# EAGLE schematic Micro_8086_Programming (2) (EAGLE 9.6.2), part 1 of 2
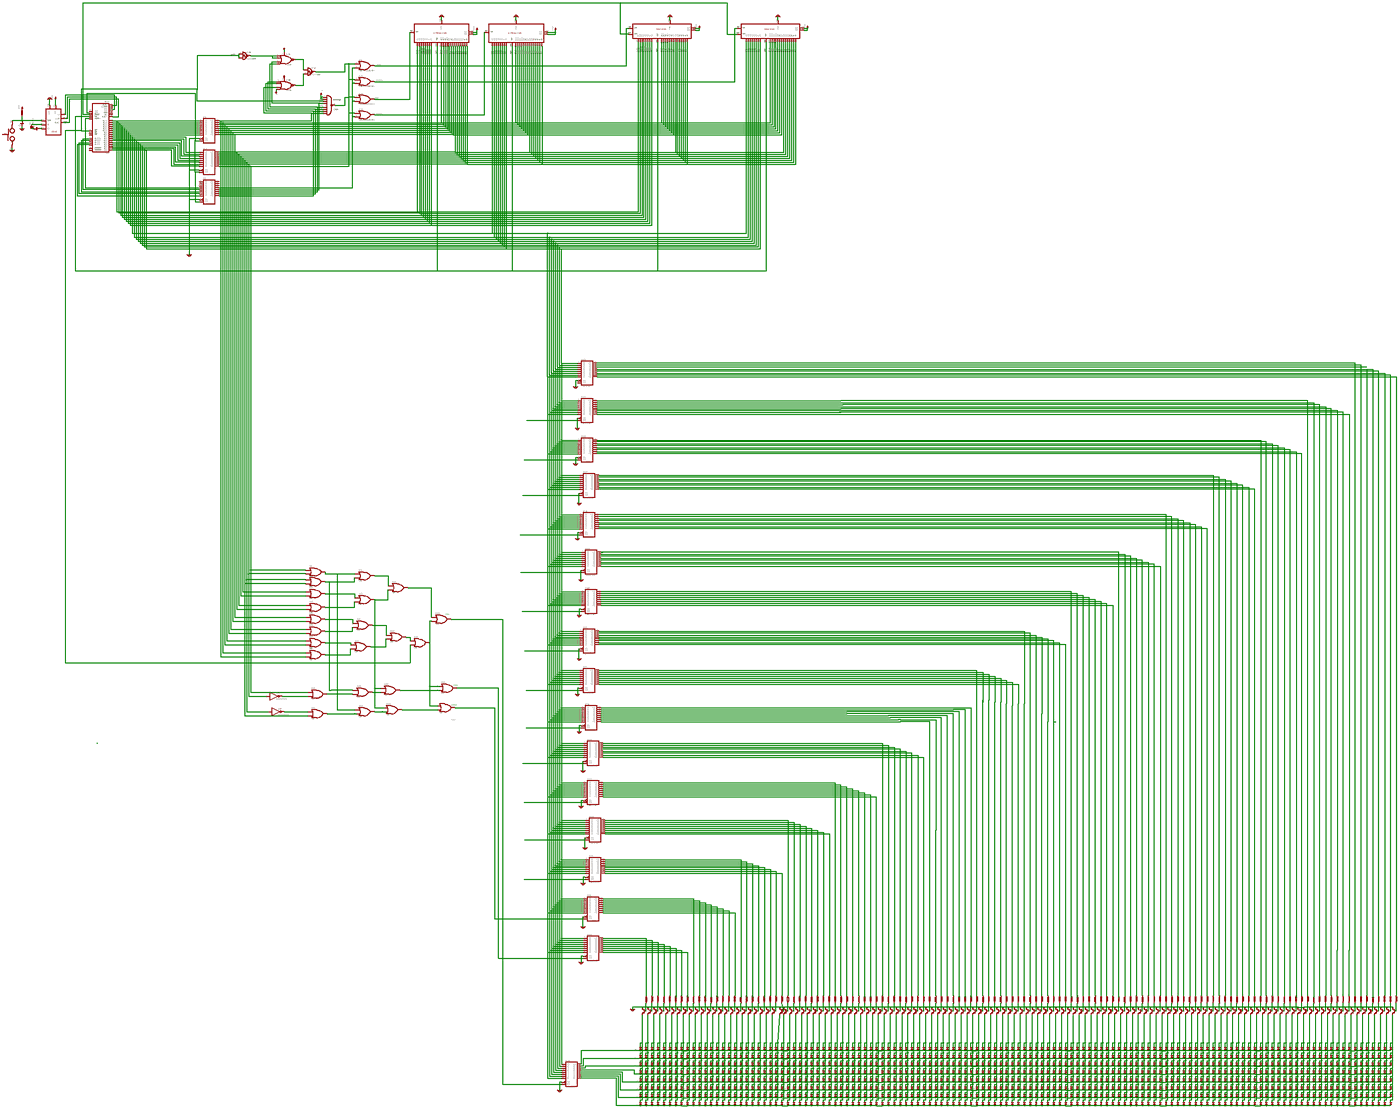
[diagram p0: schematic, sheet 1, overview]
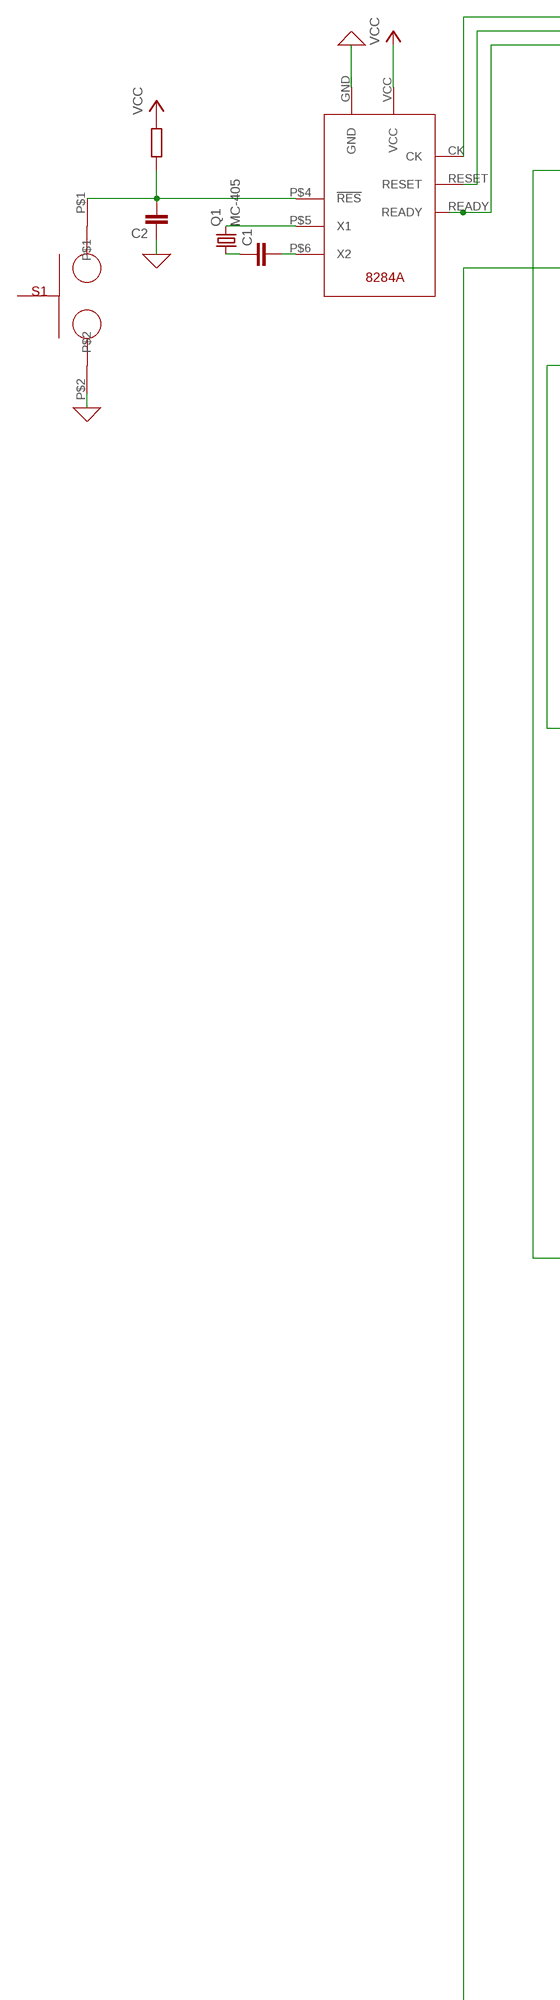
[diagram p1: schematic, sheet 1, part 1 of 8]
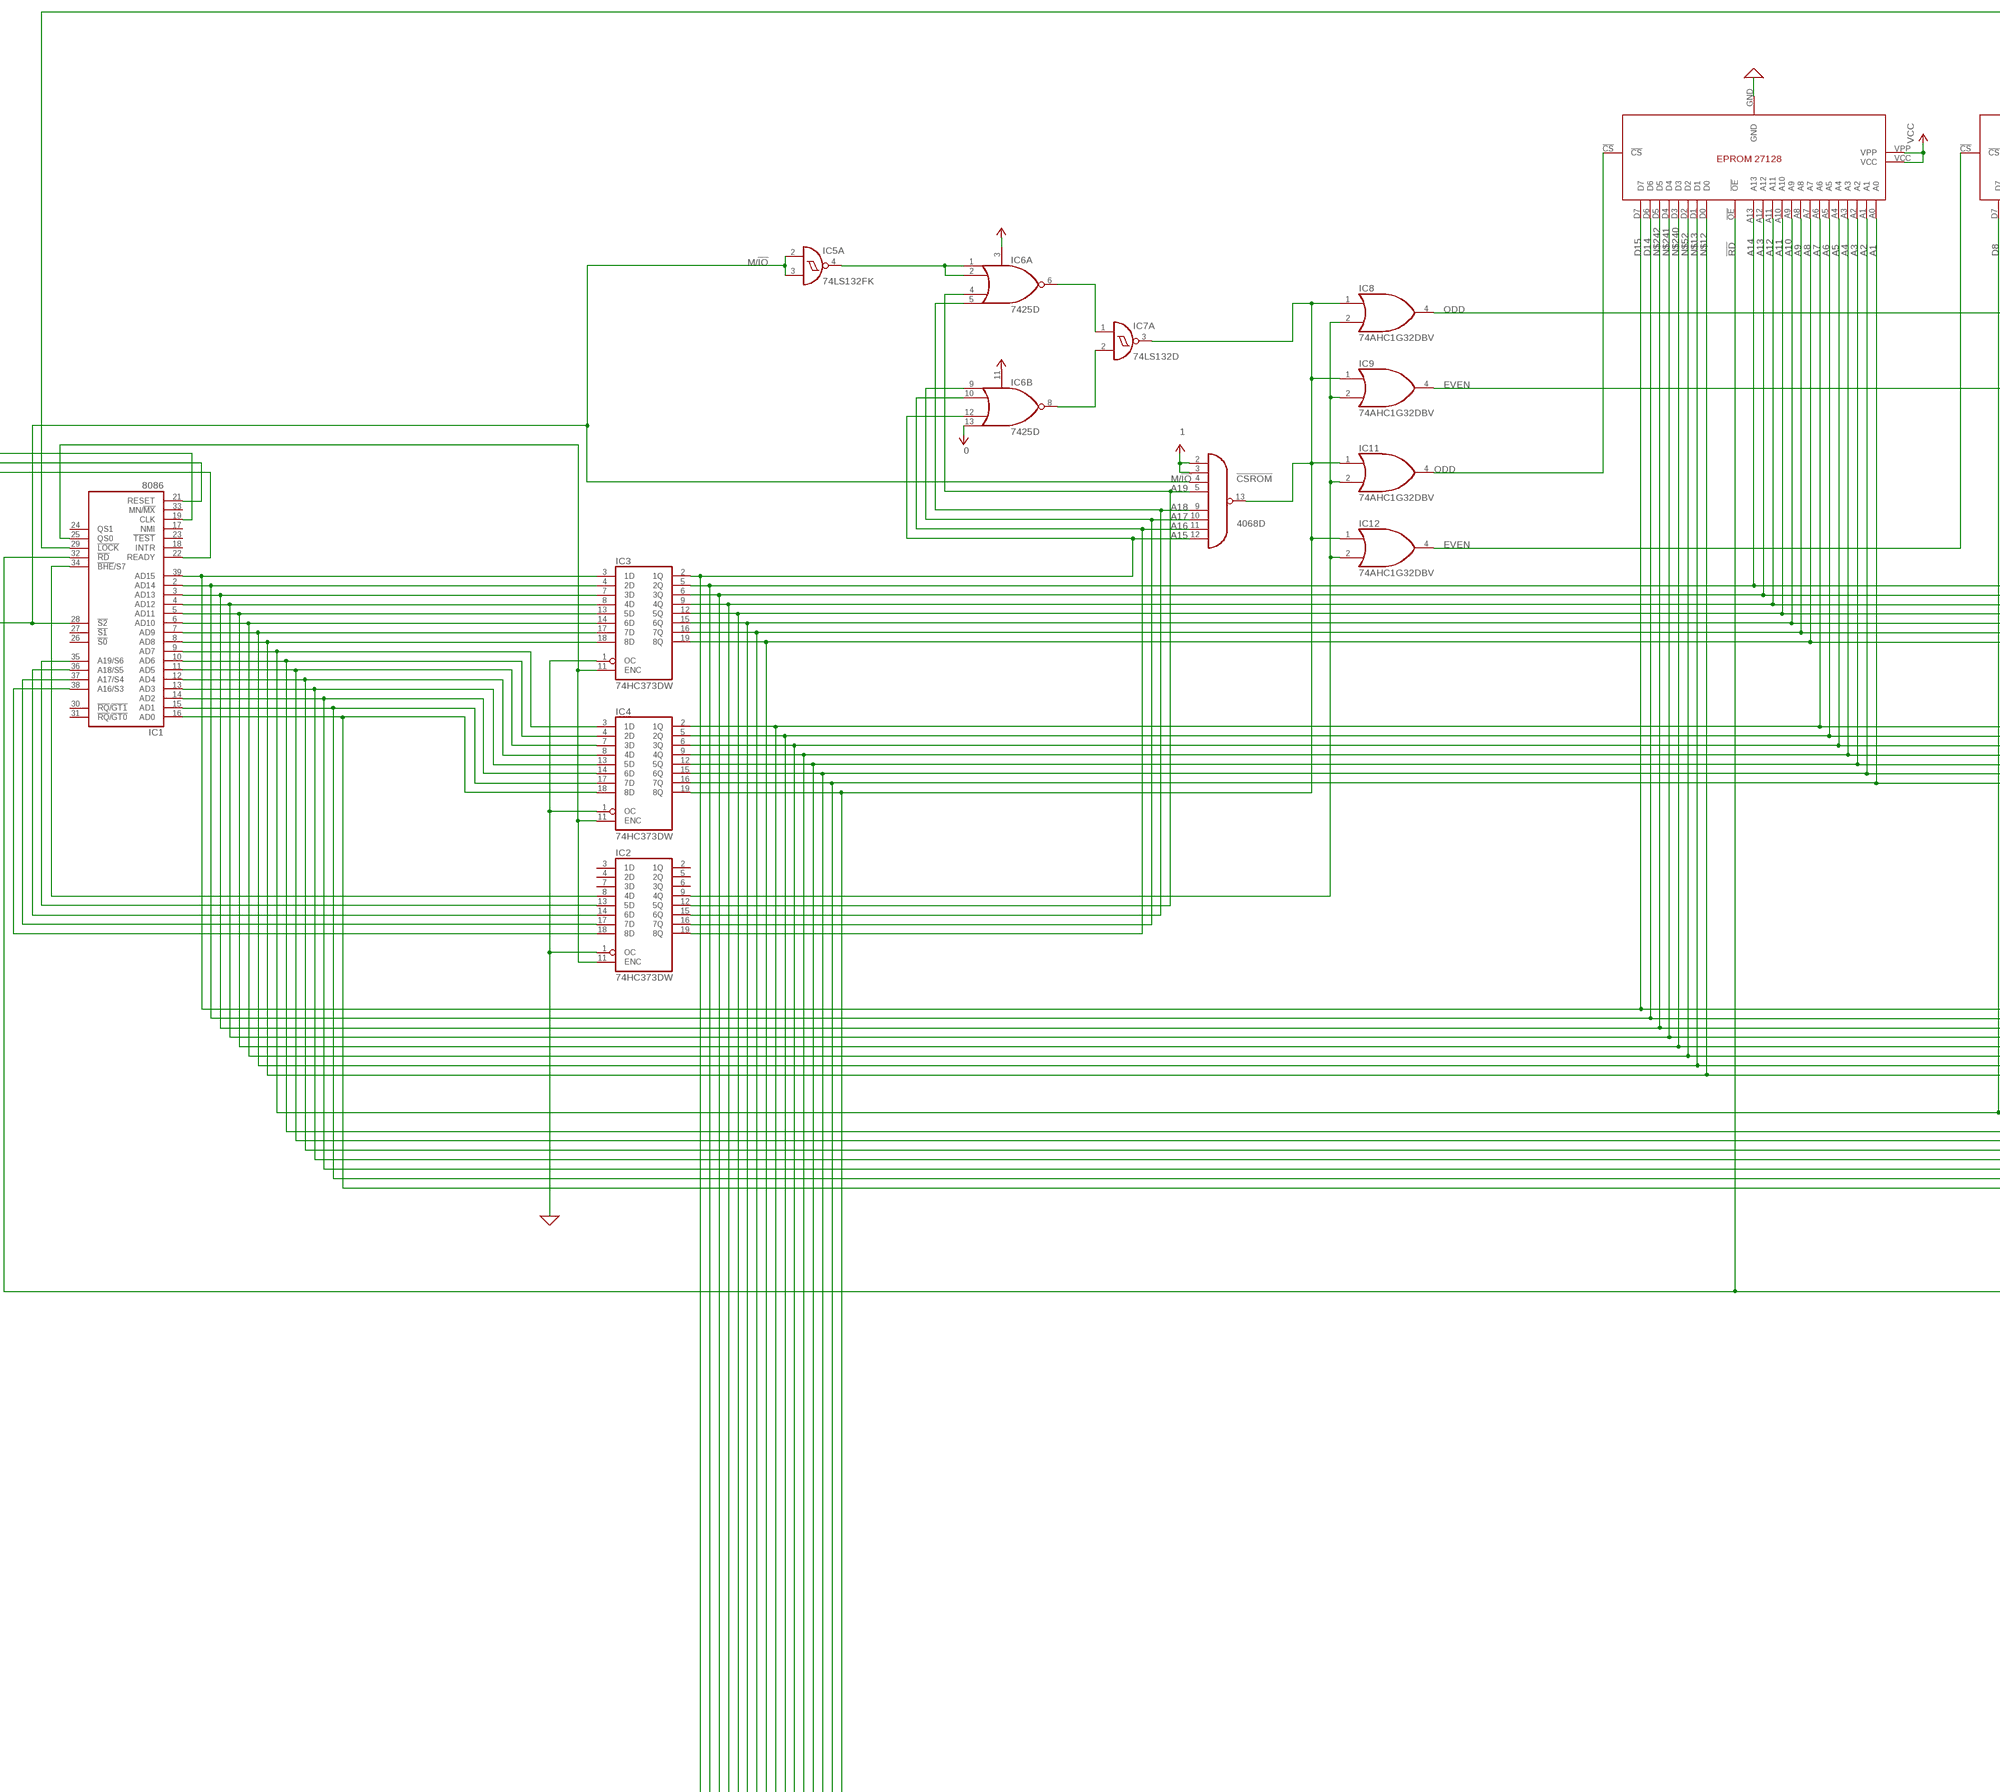
[diagram p2: schematic, sheet 1, part 2 of 8]
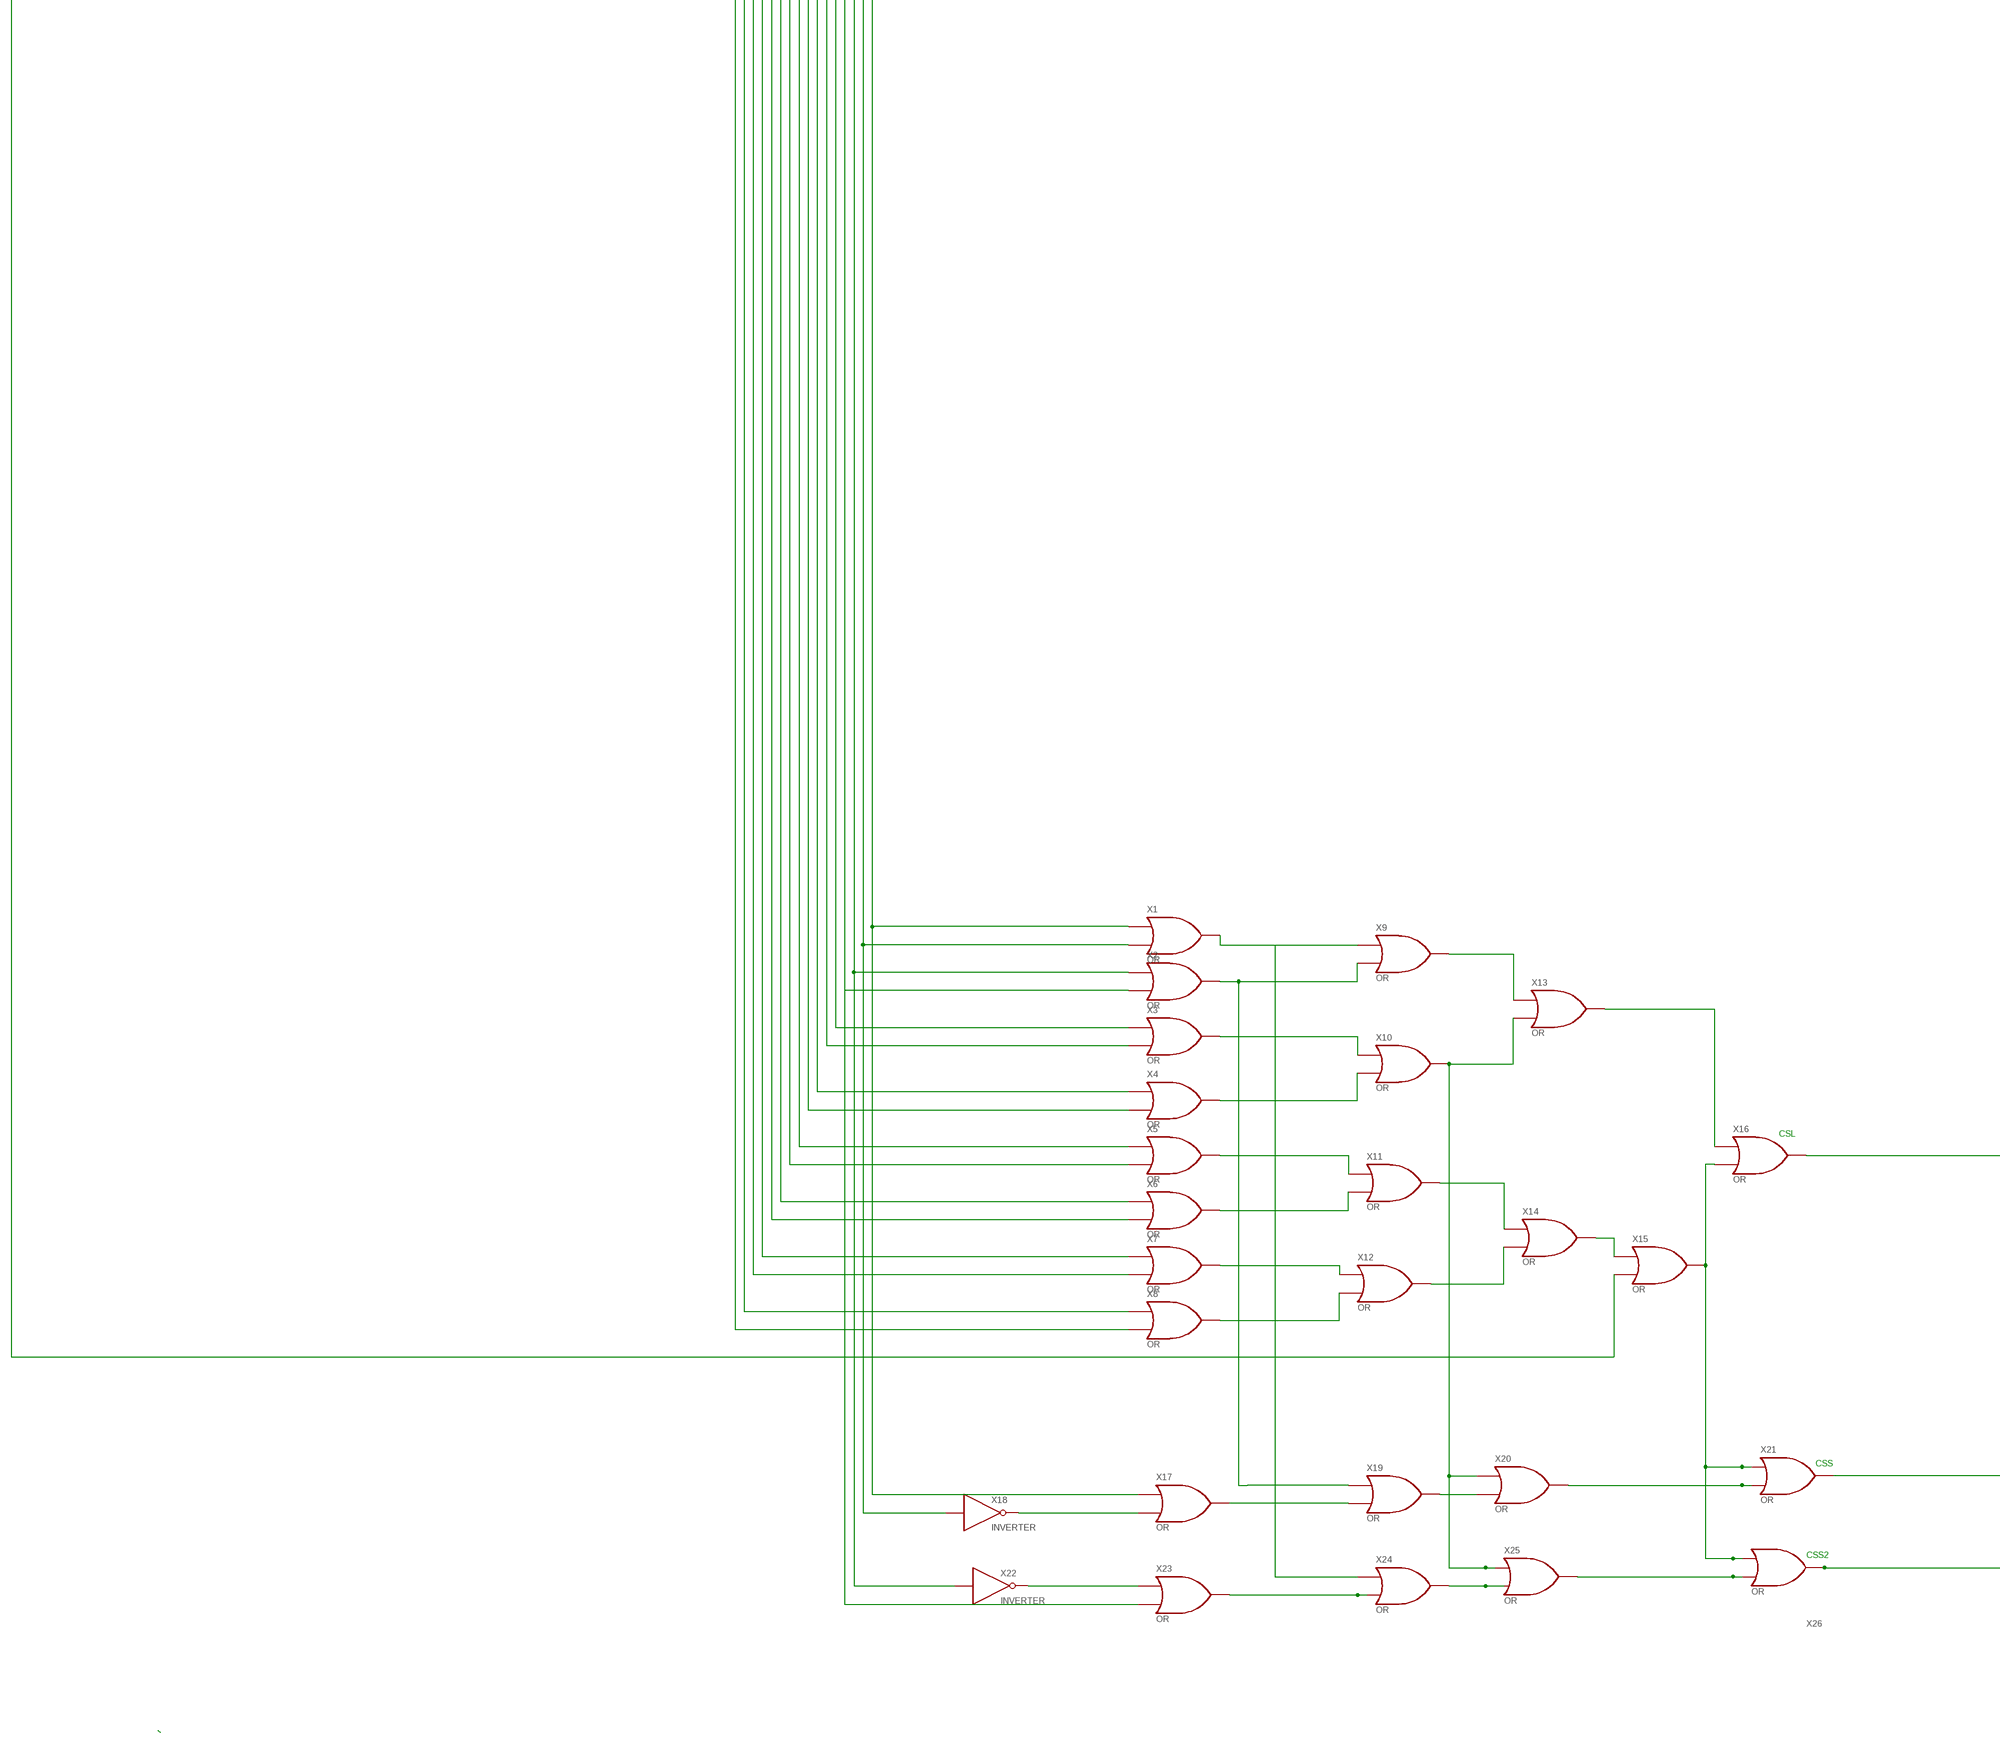
[diagram p3: schematic, sheet 1, part 3 of 8]
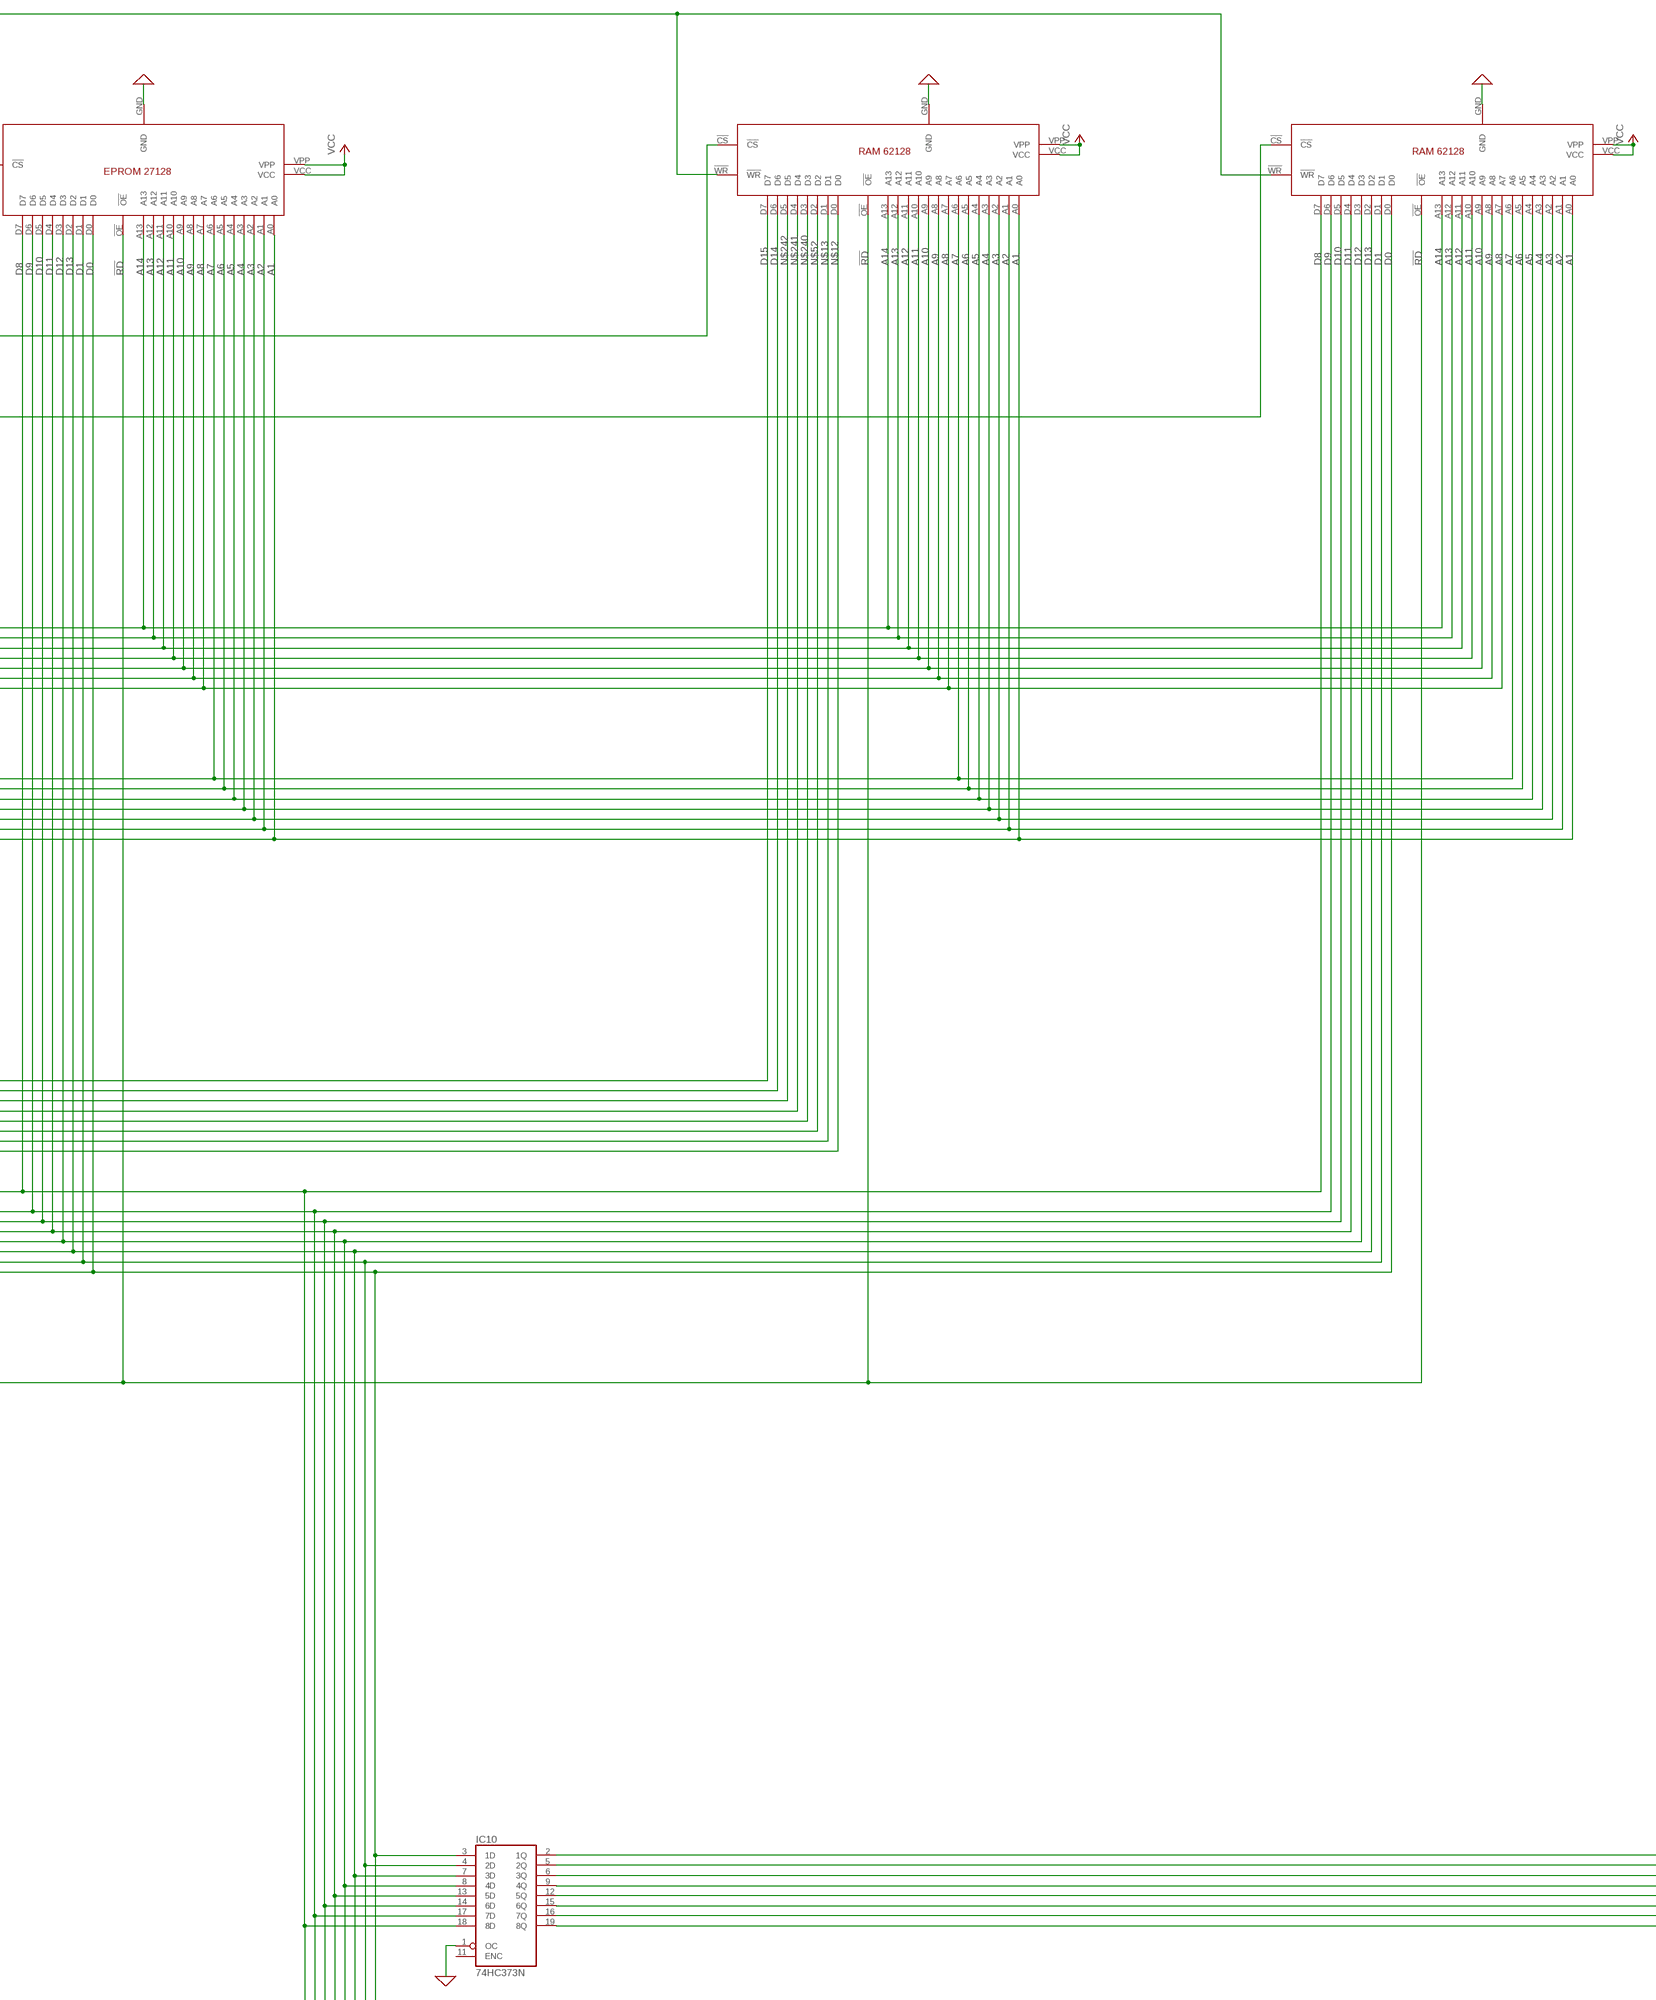
[diagram p4: schematic, sheet 1, part 4 of 8]
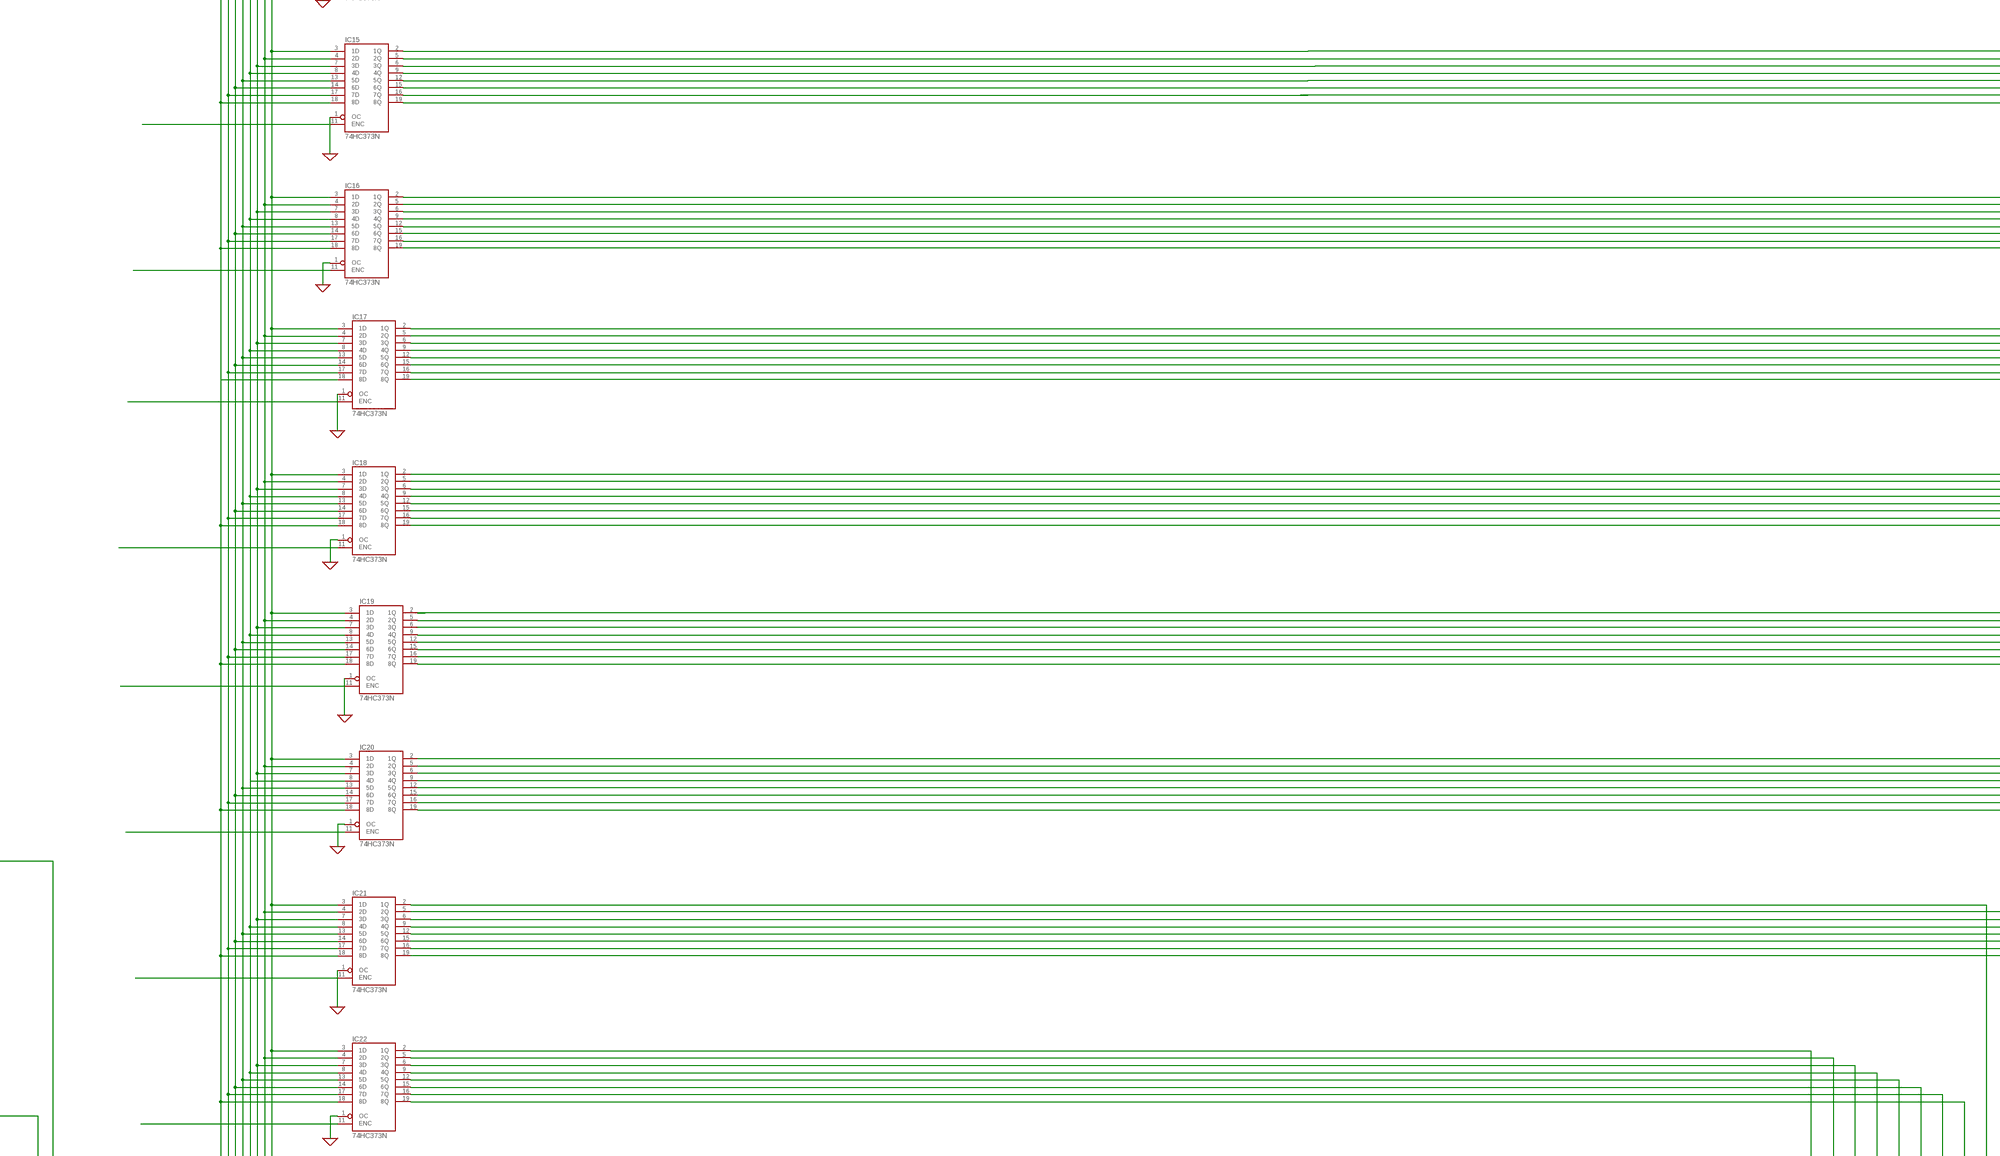
[diagram p5: schematic, sheet 1, part 5 of 8]
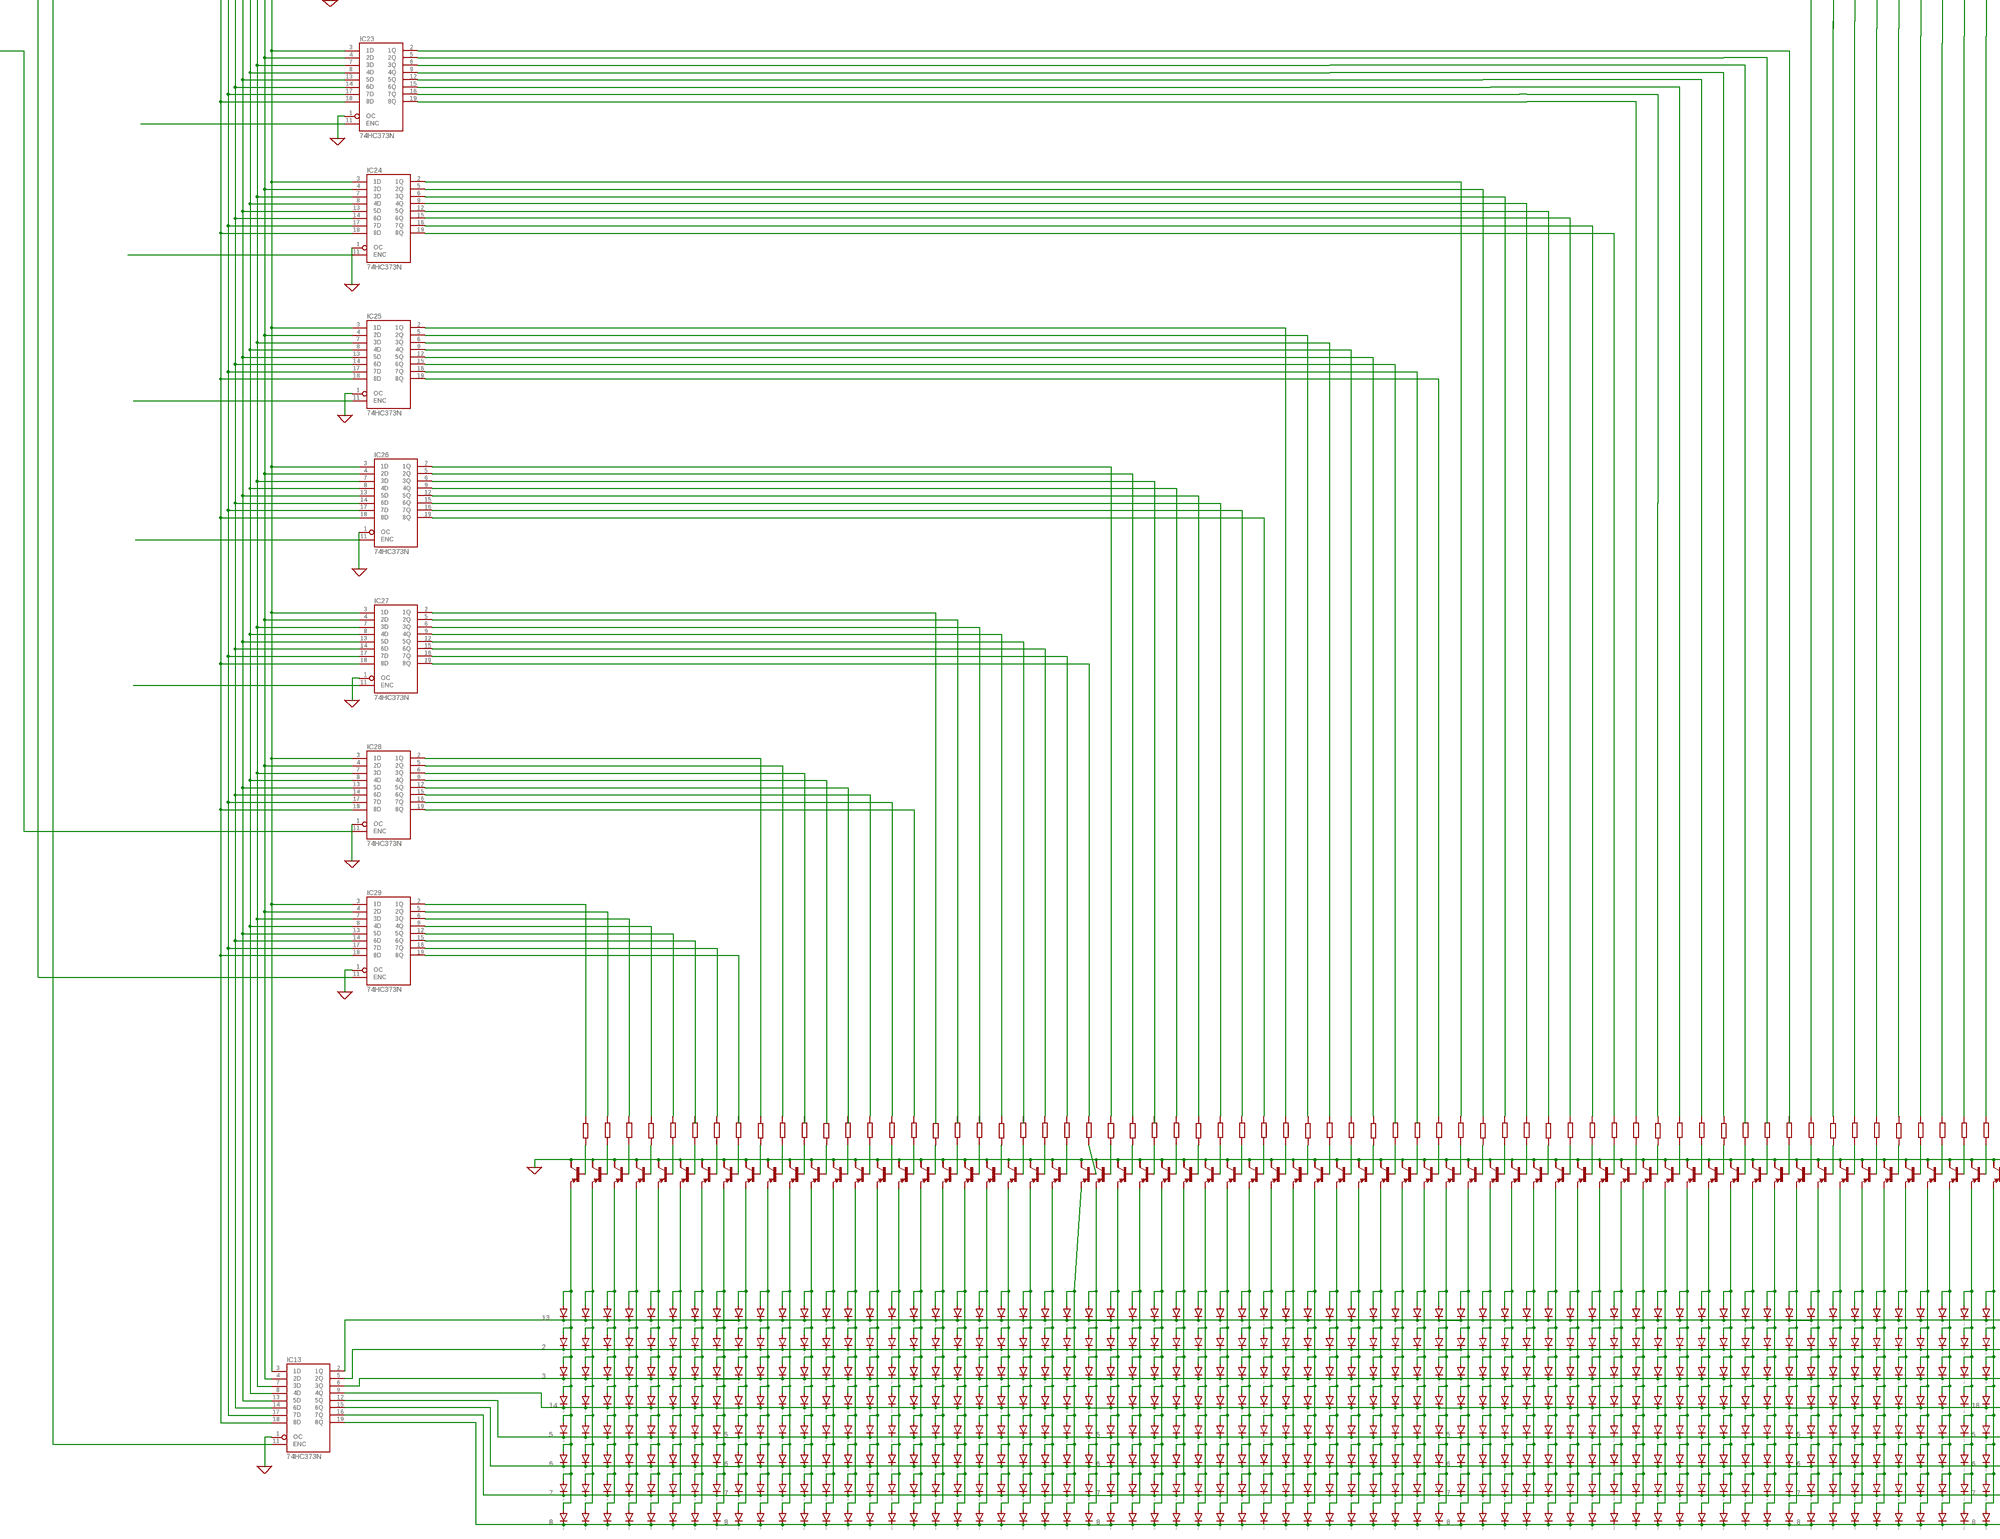
[diagram p6: schematic, sheet 1, part 6 of 8]
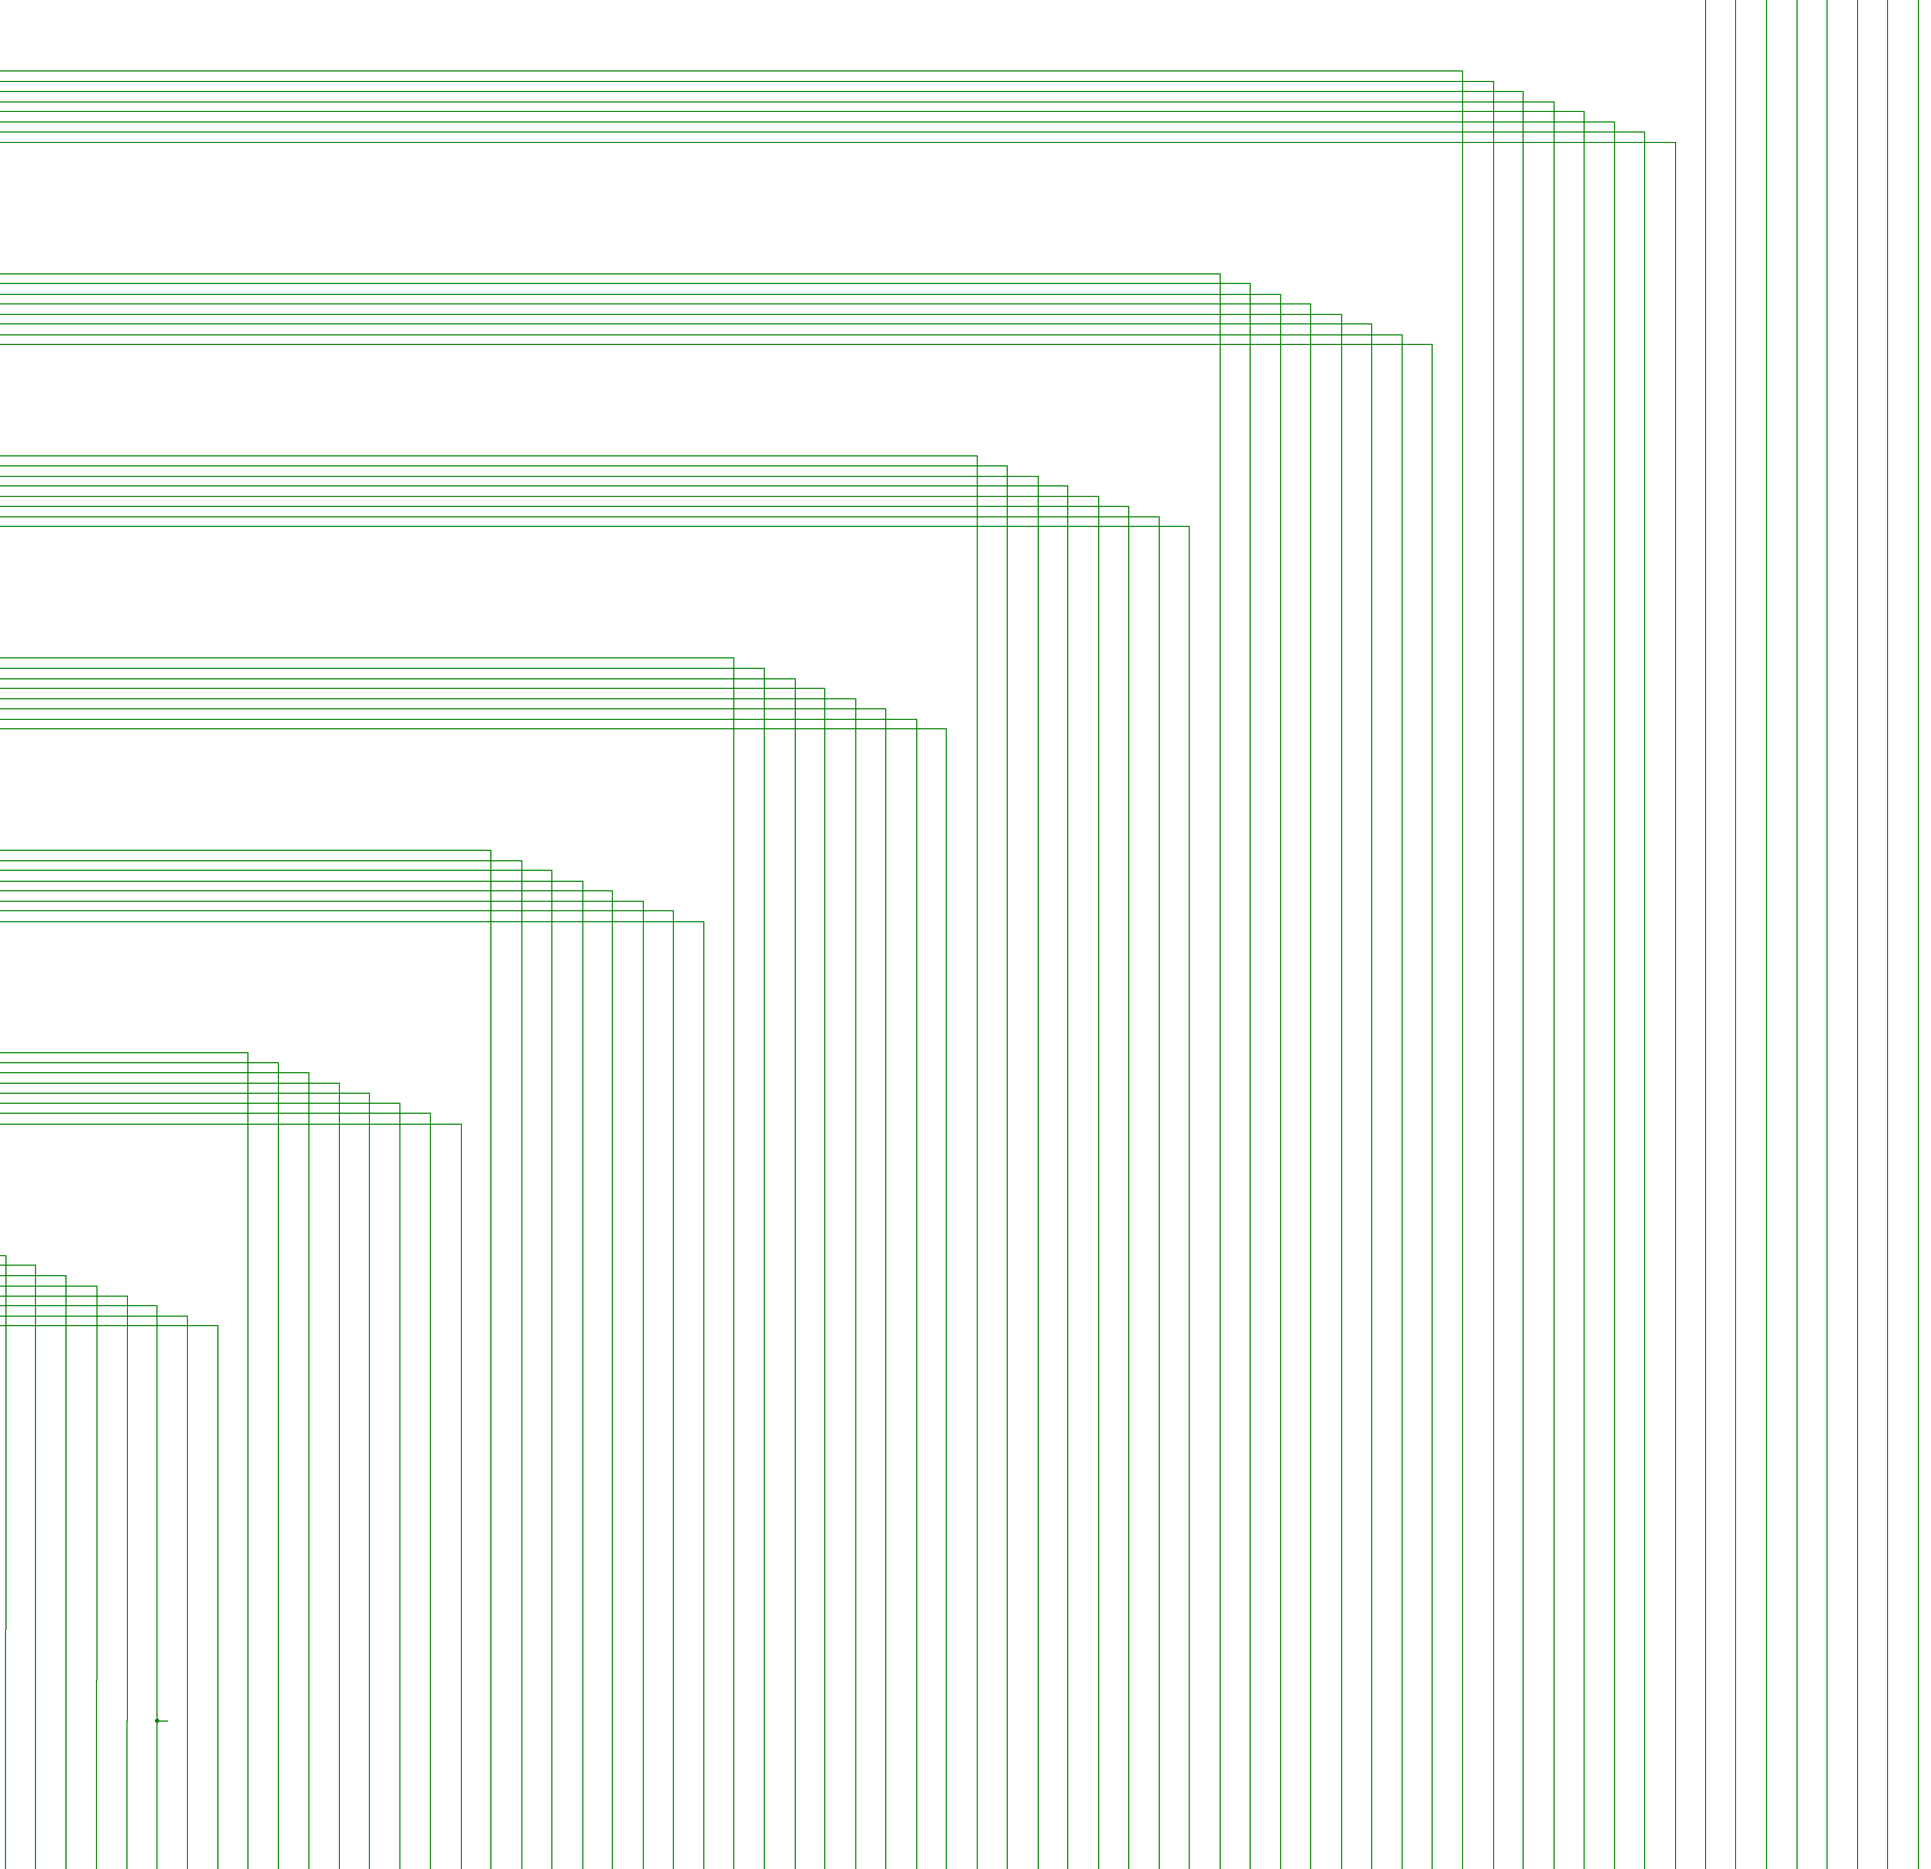
[diagram p7: schematic, sheet 1, part 7 of 8]
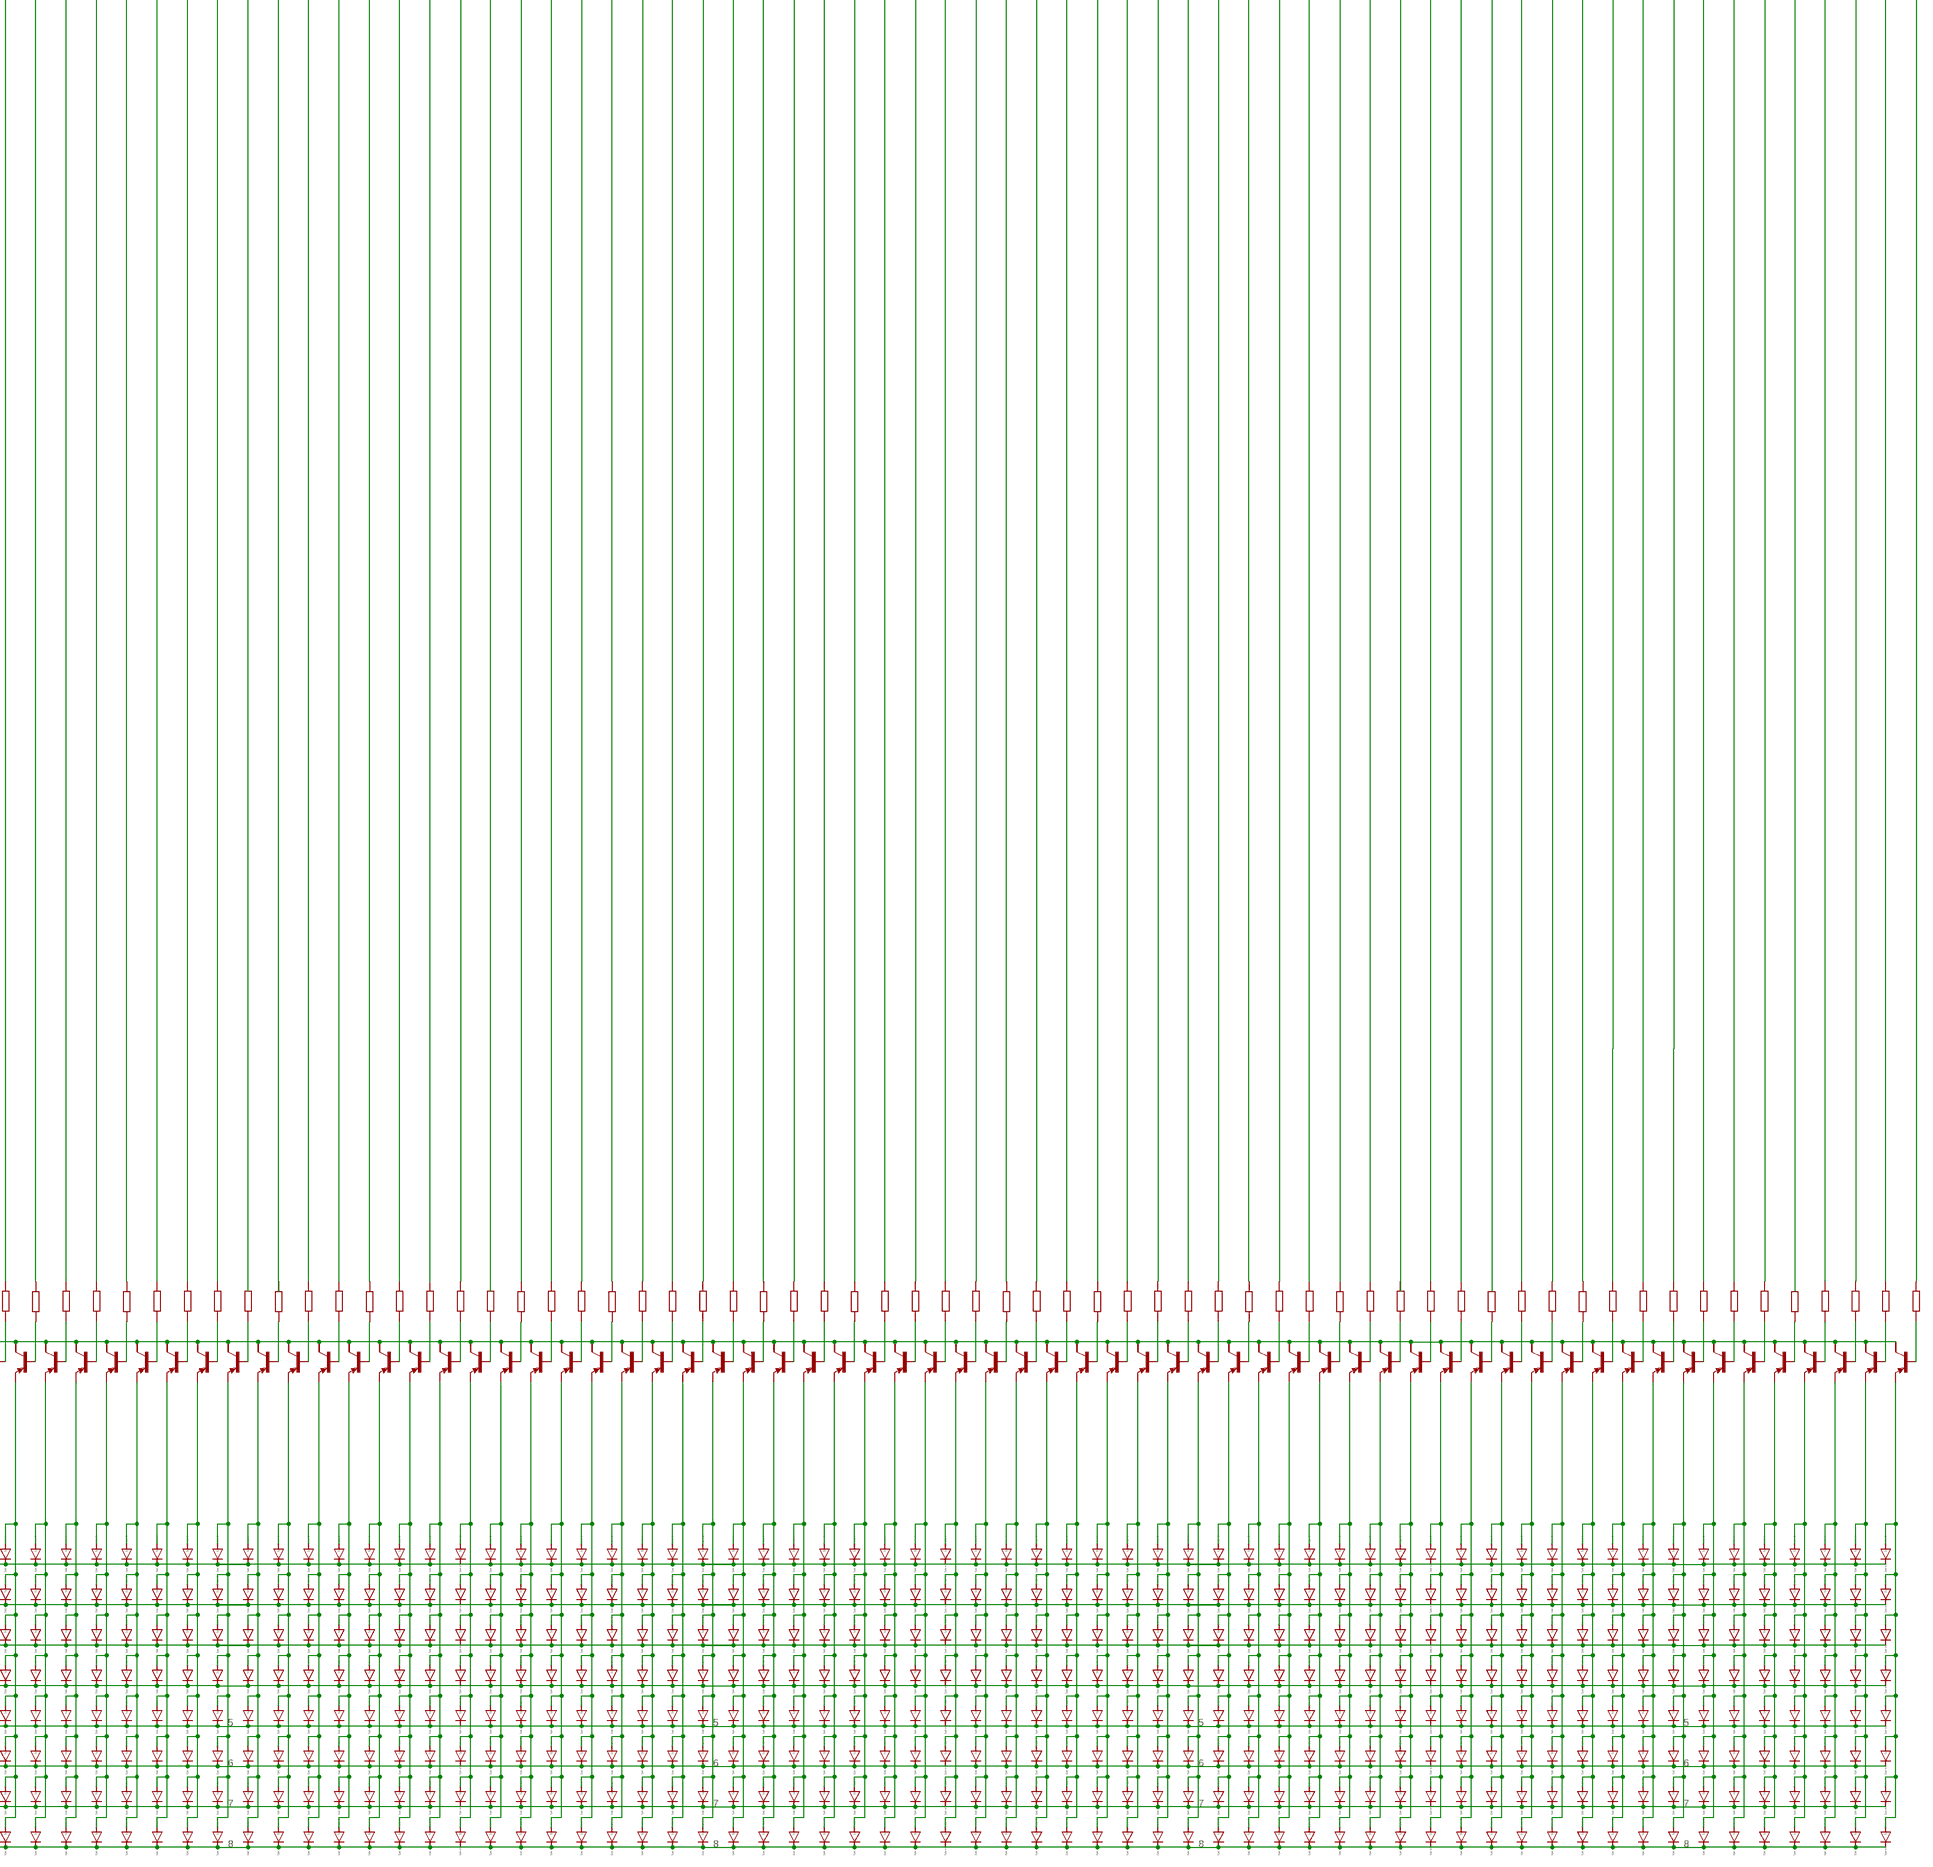
[diagram p8: schematic, sheet 1, part 8 of 8]

## Parts
!CSROM  4068D  [SO14]
C1  C2,5-3  [C2.5-3]
C2  C2,5-3  [C2.5-3]
D1  SRP100  [DO41-10]
D2  SRP100  [DO41-10]
D3  SRP100  [DO41-10]
D4  SRP100  [DO41-10]
D5  SRP100  [DO41-10]
D6  SRP100  [DO41-10]
D7  SRP100  [DO41-10]
D8  SRP100  [DO41-10]
D9  SRP100  [DO41-10]
D10  SRP100  [DO41-10]
D11  SRP100  [DO41-10]
D12  SRP100  [DO41-10]
D13  SRP100  [DO41-10]
D14  SRP100  [DO41-10]
D15  SRP100  [DO41-10]
D16  SRP100  [DO41-10]
D17  SRP100  [DO41-10]
D18  SRP100  [DO41-10]
D19  SRP100  [DO41-10]
D20  SRP100  [DO41-10]
D21  SRP100  [DO41-10]
D22  SRP100  [DO41-10]
D23  SRP100  [DO41-10]
D24  SRP100  [DO41-10]
D25  SRP100  [DO41-10]
D26  SRP100  [DO41-10]
D27  SRP100  [DO41-10]
D28  SRP100  [DO41-10]
D29  SRP100  [DO41-10]
D30  SRP100  [DO41-10]
D31  SRP100  [DO41-10]
D32  SRP100  [DO41-10]
D33  SRP100  [DO41-10]
D34  SRP100  [DO41-10]
D35  SRP100  [DO41-10]
D36  SRP100  [DO41-10]
D37  SRP100  [DO41-10]
D38  SRP100  [DO41-10]
D39  SRP100  [DO41-10]
D40  SRP100  [DO41-10]
D41  SRP100  [DO41-10]
D42  SRP100  [DO41-10]
D43  SRP100  [DO41-10]
D44  SRP100  [DO41-10]
D45  SRP100  [DO41-10]
D46  SRP100  [DO41-10]
D47  SRP100  [DO41-10]
D48  SRP100  [DO41-10]
D49  SRP100  [DO41-10]
D50  SRP100  [DO41-10]
D51  SRP100  [DO41-10]
D52  SRP100  [DO41-10]
D53  SRP100  [DO41-10]
D54  SRP100  [DO41-10]
D55  SRP100  [DO41-10]
D56  SRP100  [DO41-10]
D57  SRP100  [DO41-10]
D58  SRP100  [DO41-10]
D59  SRP100  [DO41-10]
D60  SRP100  [DO41-10]
D61  SRP100  [DO41-10]
D62  SRP100  [DO41-10]
D63  SRP100  [DO41-10]
D64  SRP100  [DO41-10]
D65  SRP100  [DO41-10]
D66  SRP100  [DO41-10]
D67  SRP100  [DO41-10]
D68  SRP100  [DO41-10]
D69  SRP100  [DO41-10]
D70  SRP100  [DO41-10]
D71  SRP100  [DO41-10]
D72  SRP100  [DO41-10]
D73  SRP100  [DO41-10]
D74  SRP100  [DO41-10]
D75  SRP100  [DO41-10]
D76  SRP100  [DO41-10]
D77  SRP100  [DO41-10]
D78  SRP100  [DO41-10]
D79  SRP100  [DO41-10]
D80  SRP100  [DO41-10]
D81  SRP100  [DO41-10]
D82  SRP100  [DO41-10]
D83  SRP100  [DO41-10]
D84  SRP100  [DO41-10]
D85  SRP100  [DO41-10]
D86  SRP100  [DO41-10]
D87  SRP100  [DO41-10]
D88  SRP100  [DO41-10]
D89  SRP100  [DO41-10]
D90  SRP100  [DO41-10]
D91  SRP100  [DO41-10]
D92  SRP100  [DO41-10]
D93  SRP100  [DO41-10]
D94  SRP100  [DO41-10]
D95  SRP100  [DO41-10]
D96  SRP100  [DO41-10]
D97  SRP100  [DO41-10]
D98  SRP100  [DO41-10]
D99  SRP100  [DO41-10]
D100  SRP100  [DO41-10]
D101  SRP100  [DO41-10]
D102  SRP100  [DO41-10]
D103  SRP100  [DO41-10]
D104  SRP100  [DO41-10]
D105  SRP100  [DO41-10]
D106  SRP100  [DO41-10]
D107  SRP100  [DO41-10]
D108  SRP100  [DO41-10]
D109  SRP100  [DO41-10]
D110  SRP100  [DO41-10]
D111  SRP100  [DO41-10]
D112  SRP100  [DO41-10]
D113  SRP100  [DO41-10]
D114  SRP100  [DO41-10]
D115  SRP100  [DO41-10]
D116  SRP100  [DO41-10]
D117  SRP100  [DO41-10]
D118  SRP100  [DO41-10]
D119  SRP100  [DO41-10]
D120  SRP100  [DO41-10]
D121  SRP100  [DO41-10]
D122  SRP100  [DO41-10]
D123  SRP100  [DO41-10]
D124  SRP100  [DO41-10]
D125  SRP100  [DO41-10]
D126  SRP100  [DO41-10]
D127  SRP100  [DO41-10]
D128  SRP100  [DO41-10]
D129  SRP100  [DO41-10]
D130  SRP100  [DO41-10]
D131  SRP100  [DO41-10]
D132  SRP100  [DO41-10]
D133  SRP100  [DO41-10]
D134  SRP100  [DO41-10]
D135  SRP100  [DO41-10]
D136  SRP100  [DO41-10]
D137  SRP100  [DO41-10]
D138  SRP100  [DO41-10]
D139  SRP100  [DO41-10]
D140  SRP100  [DO41-10]
D141  SRP100  [DO41-10]
D142  SRP100  [DO41-10]
D143  SRP100  [DO41-10]
D144  SRP100  [DO41-10]
D145  SRP100  [DO41-10]
D146  SRP100  [DO41-10]
D147  SRP100  [DO41-10]
D148  SRP100  [DO41-10]
D149  SRP100  [DO41-10]
D150  SRP100  [DO41-10]
D151  SRP100  [DO41-10]
D152  SRP100  [DO41-10]
D153  SRP100  [DO41-10]
D154  SRP100  [DO41-10]
D155  SRP100  [DO41-10]
D156  SRP100  [DO41-10]
D157  SRP100  [DO41-10]
D158  SRP100  [DO41-10]
D159  SRP100  [DO41-10]
D160  SRP100  [DO41-10]
D161  SRP100  [DO41-10]
D162  SRP100  [DO41-10]
D163  SRP100  [DO41-10]
D164  SRP100  [DO41-10]
D165  SRP100  [DO41-10]
D166  SRP100  [DO41-10]
D167  SRP100  [DO41-10]
D168  SRP100  [DO41-10]
D169  SRP100  [DO41-10]
D170  SRP100  [DO41-10]
D171  SRP100  [DO41-10]
D172  SRP100  [DO41-10]
D173  SRP100  [DO41-10]
D174  SRP100  [DO41-10]
D175  SRP100  [DO41-10]
D176  SRP100  [DO41-10]
D177  SRP100  [DO41-10]
D178  SRP100  [DO41-10]
D179  SRP100  [DO41-10]
D180  SRP100  [DO41-10]
D181  SRP100  [DO41-10]
D182  SRP100  [DO41-10]
D183  SRP100  [DO41-10]
D184  SRP100  [DO41-10]
D185  SRP100  [DO41-10]
D186  SRP100  [DO41-10]
D187  SRP100  [DO41-10]
D188  SRP100  [DO41-10]
D189  SRP100  [DO41-10]
D190  SRP100  [DO41-10]
D191  SRP100  [DO41-10]
D192  SRP100  [DO41-10]
D193  SRP100  [DO41-10]
D194  SRP100  [DO41-10]
D195  SRP100  [DO41-10]
D196  SRP100  [DO41-10]
D197  SRP100  [DO41-10]
D198  SRP100  [DO41-10]
D199  SRP100  [DO41-10]
D200  SRP100  [DO41-10]
D201  SRP100  [DO41-10]
D202  SRP100  [DO41-10]
D203  SRP100  [DO41-10]
D204  SRP100  [DO41-10]
D205  SRP100  [DO41-10]
D206  SRP100  [DO41-10]
D207  SRP100  [DO41-10]
D208  SRP100  [DO41-10]
D209  SRP100  [DO41-10]
D210  SRP100  [DO41-10]
D211  SRP100  [DO41-10]
D212  SRP100  [DO41-10]
D213  SRP100  [DO41-10]
D214  SRP100  [DO41-10]
D215  SRP100  [DO41-10]
D216  SRP100  [DO41-10]
D217  SRP100  [DO41-10]
D218  SRP100  [DO41-10]
D219  SRP100  [DO41-10]
D220  SRP100  [DO41-10]
D221  SRP100  [DO41-10]
D222  SRP100  [DO41-10]
D223  SRP100  [DO41-10]
D224  SRP100  [DO41-10]
D225  SRP100  [DO41-10]
D226  SRP100  [DO41-10]
D227  SRP100  [DO41-10]
D228  SRP100  [DO41-10]
D229  SRP100  [DO41-10]
D230  SRP100  [DO41-10]
D231  SRP100  [DO41-10]
D232  SRP100  [DO41-10]
D233  SRP100  [DO41-10]
D234  SRP100  [DO41-10]
D235  SRP100  [DO41-10]
D236  SRP100  [DO41-10]
D237  SRP100  [DO41-10]
D238  SRP100  [DO41-10]
D239  SRP100  [DO41-10]
D240  SRP100  [DO41-10]
D241  SRP100  [DO41-10]
D242  SRP100  [DO41-10]
D243  SRP100  [DO41-10]
D244  SRP100  [DO41-10]
D245  SRP100  [DO41-10]
D246  SRP100  [DO41-10]
D247  SRP100  [DO41-10]
D248  SRP100  [DO41-10]
D249  SRP100  [DO41-10]
D250  SRP100  [DO41-10]
D251  SRP100  [DO41-10]
D252  SRP100  [DO41-10]
D253  SRP100  [DO41-10]
D254  SRP100  [DO41-10]
D255  SRP100  [DO41-10]
D256  SRP100  [DO41-10]
D257  SRP100  [DO41-10]
D258  SRP100  [DO41-10]
D259  SRP100  [DO41-10]
D260  SRP100  [DO41-10]
D261  SRP100  [DO41-10]
D262  SRP100  [DO41-10]
D263  SRP100  [DO41-10]
D264  SRP100  [DO41-10]
D265  SRP100  [DO41-10]
D266  SRP100  [DO41-10]
D267  SRP100  [DO41-10]
D268  SRP100  [DO41-10]
D269  SRP100  [DO41-10]
D270  SRP100  [DO41-10]
D271  SRP100  [DO41-10]
D272  SRP100  [DO41-10]
D273  SRP100  [DO41-10]
D274  SRP100  [DO41-10]
D275  SRP100  [DO41-10]
D276  SRP100  [DO41-10]
D277  SRP100  [DO41-10]
D278  SRP100  [DO41-10]
D279  SRP100  [DO41-10]
D280  SRP100  [DO41-10]
D281  SRP100  [DO41-10]
D282  SRP100  [DO41-10]
D283  SRP100  [DO41-10]
D284  SRP100  [DO41-10]
D285  SRP100  [DO41-10]
D286  SRP100  [DO41-10]
D287  SRP100  [DO41-10]
D288  SRP100  [DO41-10]
D289  SRP100  [DO41-10]
D290  SRP100  [DO41-10]
D291  SRP100  [DO41-10]
D292  SRP100  [DO41-10]
D293  SRP100  [DO41-10]
D294  SRP100  [DO41-10]
D295  SRP100  [DO41-10]
D296  SRP100  [DO41-10]
D297  SRP100  [DO41-10]
D298  SRP100  [DO41-10]
D299  SRP100  [DO41-10]
D300  SRP100  [DO41-10]
D301  SRP100  [DO41-10]
D302  SRP100  [DO41-10]
D303  SRP100  [DO41-10]
D304  SRP100  [DO41-10]
D305  SRP100  [DO41-10]
D306  SRP100  [DO41-10]
D307  SRP100  [DO41-10]
D308  SRP100  [DO41-10]
D309  SRP100  [DO41-10]
D310  SRP100  [DO41-10]
D311  SRP100  [DO41-10]
D312  SRP100  [DO41-10]
D313  SRP100  [DO41-10]
D314  SRP100  [DO41-10]
D315  SRP100  [DO41-10]
D316  SRP100  [DO41-10]
D317  SRP100  [DO41-10]
D318  SRP100  [DO41-10]
D319  SRP100  [DO41-10]
D320  SRP100  [DO41-10]
D321  SRP100  [DO41-10]
D322  SRP100  [DO41-10]
D323  SRP100  [DO41-10]
D324  SRP100  [DO41-10]
D325  SRP100  [DO41-10]
D326  SRP100  [DO41-10]
D327  SRP100  [DO41-10]
D328  SRP100  [DO41-10]
D329  SRP100  [DO41-10]
D330  SRP100  [DO41-10]
D331  SRP100  [DO41-10]
D332  SRP100  [DO41-10]
D333  SRP100  [DO41-10]
D334  SRP100  [DO41-10]
D335  SRP100  [DO41-10]
D336  SRP100  [DO41-10]
D337  SRP100  [DO41-10]
D338  SRP100  [DO41-10]
D339  SRP100  [DO41-10]
D340  SRP100  [DO41-10]
D341  SRP100  [DO41-10]
D342  SRP100  [DO41-10]
D343  SRP100  [DO41-10]
D344  SRP100  [DO41-10]
D345  SRP100  [DO41-10]
D346  SRP100  [DO41-10]
D347  SRP100  [DO41-10]
D348  SRP100  [DO41-10]
D349  SRP100  [DO41-10]
D350  SRP100  [DO41-10]
D351  SRP100  [DO41-10]
D352  SRP100  [DO41-10]
D353  SRP100  [DO41-10]
D354  SRP100  [DO41-10]
D355  SRP100  [DO41-10]
D356  SRP100  [DO41-10]
D357  SRP100  [DO41-10]
D358  SRP100  [DO41-10]
D359  SRP100  [DO41-10]
D360  SRP100  [DO41-10]
D361  SRP100  [DO41-10]
D362  SRP100  [DO41-10]
D363  SRP100  [DO41-10]
D364  SRP100  [DO41-10]
D365  SRP100  [DO41-10]
D366  SRP100  [DO41-10]
D367  SRP100  [DO41-10]
D368  SRP100  [DO41-10]
D369  SRP100  [DO41-10]
D370  SRP100  [DO41-10]
D371  SRP100  [DO41-10]
D372  SRP100  [DO41-10]
D373  SRP100  [DO41-10]
D374  SRP100  [DO41-10]
D375  SRP100  [DO41-10]
D376  SRP100  [DO41-10]
D377  SRP100  [DO41-10]
D378  SRP100  [DO41-10]
D379  SRP100  [DO41-10]
D380  SRP100  [DO41-10]
D381  SRP100  [DO41-10]
D382  SRP100  [DO41-10]
D383  SRP100  [DO41-10]
D384  SRP100  [DO41-10]
D385  SRP100  [DO41-10]
D386  SRP100  [DO41-10]
D387  SRP100  [DO41-10]
D388  SRP100  [DO41-10]
D389  SRP100  [DO41-10]
D390  SRP100  [DO41-10]
D391  SRP100  [DO41-10]
D392  SRP100  [DO41-10]
D393  SRP100  [DO41-10]
D394  SRP100  [DO41-10]
D395  SRP100  [DO41-10]
D396  SRP100  [DO41-10]
D397  SRP100  [DO41-10]
D398  SRP100  [DO41-10]
D399  SRP100  [DO41-10]
D400  SRP100  [DO41-10]
D401  SRP100  [DO41-10]
D402  SRP100  [DO41-10]
D403  SRP100  [DO41-10]
D404  SRP100  [DO41-10]
D405  SRP100  [DO41-10]
D406  SRP100  [DO41-10]
D407  SRP100  [DO41-10]
D408  SRP100  [DO41-10]
D409  SRP100  [DO41-10]
D410  SRP100  [DO41-10]
D411  SRP100  [DO41-10]
D412  SRP100  [DO41-10]
D413  SRP100  [DO41-10]
D414  SRP100  [DO41-10]
D415  SRP100  [DO41-10]
D416  SRP100  [DO41-10]
D417  SRP100  [DO41-10]
D418  SRP100  [DO41-10]
D419  SRP100  [DO41-10]
D420  SRP100  [DO41-10]
D421  SRP100  [DO41-10]
D422  SRP100  [DO41-10]
D423  SRP100  [DO41-10]
D424  SRP100  [DO41-10]
D425  SRP100  [DO41-10]
D426  SRP100  [DO41-10]
D427  SRP100  [DO41-10]
D428  SRP100  [DO41-10]
D429  SRP100  [DO41-10]
D430  SRP100  [DO41-10]
D431  SRP100  [DO41-10]
D432  SRP100  [DO41-10]
D433  SRP100  [DO41-10]
D434  SRP100  [DO41-10]
D435  SRP100  [DO41-10]
D436  SRP100  [DO41-10]
D437  SRP100  [DO41-10]
D438  SRP100  [DO41-10]
D439  SRP100  [DO41-10]
D440  SRP100  [DO41-10]
D441  SRP100  [DO41-10]
D442  SRP100  [DO41-10]
D443  SRP100  [DO41-10]
D444  SRP100  [DO41-10]
D445  SRP100  [DO41-10]
D446  SRP100  [DO41-10]
D447  SRP100  [DO41-10]
D448  SRP100  [DO41-10]
D449  SRP100  [DO41-10]
D450  SRP100  [DO41-10]
D451  SRP100  [DO41-10]
D452  SRP100  [DO41-10]
D453  SRP100  [DO41-10]
D454  SRP100  [DO41-10]
D455  SRP100  [DO41-10]
D456  SRP100  [DO41-10]
D457  SRP100  [DO41-10]
D458  SRP100  [DO41-10]
D459  SRP100  [DO41-10]
D460  SRP100  [DO41-10]
D461  SRP100  [DO41-10]
D462  SRP100  [DO41-10]
D463  SRP100  [DO41-10]
D464  SRP100  [DO41-10]
D465  SRP100  [DO41-10]
D466  SRP100  [DO41-10]
D467  SRP100  [DO41-10]
D468  SRP100  [DO41-10]
D469  SRP100  [DO41-10]
D470  SRP100  [DO41-10]
D471  SRP100  [DO41-10]
D472  SRP100  [DO41-10]
D473  SRP100  [DO41-10]
D474  SRP100  [DO41-10]
D475  SRP100  [DO41-10]
D476  SRP100  [DO41-10]
D477  SRP100  [DO41-10]
D478  SRP100  [DO41-10]
D479  SRP100  [DO41-10]
D480  SRP100  [DO41-10]
D481  SRP100  [DO41-10]
D482  SRP100  [DO41-10]
D483  SRP100  [DO41-10]
D484  SRP100  [DO41-10]
D485  SRP100  [DO41-10]
D486  SRP100  [DO41-10]
D487  SRP100  [DO41-10]
D488  SRP100  [DO41-10]
D489  SRP100  [DO41-10]
D490  SRP100  [DO41-10]
D491  SRP100  [DO41-10]
D492  SRP100  [DO41-10]
D493  SRP100  [DO41-10]
D494  SRP100  [DO41-10]
D495  SRP100  [DO41-10]
D496  SRP100  [DO41-10]
D497  SRP100  [DO41-10]
D498  SRP100  [DO41-10]
D499  SRP100  [DO41-10]
D500  SRP100  [DO41-10]
D501  SRP100  [DO41-10]
D502  SRP100  [DO41-10]
D503  SRP100  [DO41-10]
D504  SRP100  [DO41-10]
D505  SRP100  [DO41-10]
D506  SRP100  [DO41-10]
D507  SRP100  [DO41-10]
D508  SRP100  [DO41-10]
D509  SRP100  [DO41-10]
D510  SRP100  [DO41-10]
D511  SRP100  [DO41-10]
D512  SRP100  [DO41-10]
D513  SRP100  [DO41-10]
D514  SRP100  [DO41-10]
D515  SRP100  [DO41-10]
D516  SRP100  [DO41-10]
D517  SRP100  [DO41-10]
D518  SRP100  [DO41-10]
D519  SRP100  [DO41-10]
D520  SRP100  [DO41-10]
D521  SRP100  [DO41-10]
D522  SRP100  [DO41-10]
D523  SRP100  [DO41-10]
D524  SRP100  [DO41-10]
D525  SRP100  [DO41-10]
D526  SRP100  [DO41-10]
D527  SRP100  [DO41-10]
D528  SRP100  [DO41-10]
D529  SRP100  [DO41-10]
D530  SRP100  [DO41-10]
D531  SRP100  [DO41-10]
D532  SRP100  [DO41-10]
D533  SRP100  [DO41-10]
D534  SRP100  [DO41-10]
D535  SRP100  [DO41-10]
D536  SRP100  [DO41-10]
D537  SRP100  [DO41-10]
D538  SRP100  [DO41-10]
D539  SRP100  [DO41-10]
D540  SRP100  [DO41-10]
D541  SRP100  [DO41-10]
D542  SRP100  [DO41-10]
D543  SRP100  [DO41-10]
D544  SRP100  [DO41-10]
D545  SRP100  [DO41-10]
D546  SRP100  [DO41-10]
D547  SRP100  [DO41-10]
D548  SRP100  [DO41-10]
D549  SRP100  [DO41-10]
D550  SRP100  [DO41-10]
D551  SRP100  [DO41-10]
D552  SRP100  [DO41-10]
D553  SRP100  [DO41-10]
D554  SRP100  [DO41-10]
D555  SRP100  [DO41-10]
D556  SRP100  [DO41-10]
D557  SRP100  [DO41-10]
D558  SRP100  [DO41-10]
D559  SRP100  [DO41-10]
D560  SRP100  [DO41-10]
D561  SRP100  [DO41-10]
D562  SRP100  [DO41-10]
D563  SRP100  [DO41-10]
D564  SRP100  [DO41-10]
D565  SRP100  [DO41-10]
D566  SRP100  [DO41-10]
D567  SRP100  [DO41-10]
D568  SRP100  [DO41-10]
D569  SRP100  [DO41-10]
D570  SRP100  [DO41-10]
D571  SRP100  [DO41-10]
D572  SRP100  [DO41-10]
D573  SRP100  [DO41-10]
D574  SRP100  [DO41-10]
D575  SRP100  [DO41-10]
D576  SRP100  [DO41-10]
D577  SRP100  [DO41-10]
D578  SRP100  [DO41-10]
D579  SRP100  [DO41-10]
D580  SRP100  [DO41-10]
D581  SRP100  [DO41-10]
D582  SRP100  [DO41-10]
D583  SRP100  [DO41-10]
D584  SRP100  [DO41-10]
D585  SRP100  [DO41-10]
D586  SRP100  [DO41-10]
D587  SRP100  [DO41-10]
D588  SRP100  [DO41-10]
D589  SRP100  [DO41-10]
D590  SRP100  [DO41-10]
D591  SRP100  [DO41-10]
D592  SRP100  [DO41-10]
D593  SRP100  [DO41-10]
D594  SRP100  [DO41-10]
D595  SRP100  [DO41-10]
D596  SRP100  [DO41-10]
D597  SRP100  [DO41-10]
D598  SRP100  [DO41-10]
D599  SRP100  [DO41-10]
D600  SRP100  [DO41-10]
D601  SRP100  [DO41-10]
D602  SRP100  [DO41-10]
D603  SRP100  [DO41-10]
D604  SRP100  [DO41-10]
D605  SRP100  [DO41-10]
D606  SRP100  [DO41-10]
D607  SRP100  [DO41-10]
D608  SRP100  [DO41-10]
D609  SRP100  [DO41-10]
D610  SRP100  [DO41-10]
D611  SRP100  [DO41-10]
D612  SRP100  [DO41-10]
D613  SRP100  [DO41-10]
D614  SRP100  [DO41-10]
D615  SRP100  [DO41-10]
D616  SRP100  [DO41-10]
D617  SRP100  [DO41-10]
D618  SRP100  [DO41-10]
D619  SRP100  [DO41-10]
D620  SRP100  [DO41-10]
D621  SRP100  [DO41-10]
D622  SRP100  [DO41-10]
D623  SRP100  [DO41-10]
D624  SRP100  [DO41-10]
D625  SRP100  [DO41-10]
D626  SRP100  [DO41-10]
D627  SRP100  [DO41-10]
D628  SRP100  [DO41-10]
D629  SRP100  [DO41-10]
D630  SRP100  [DO41-10]
D631  SRP100  [DO41-10]
D632  SRP100  [DO41-10]
D633  SRP100  [DO41-10]
D634  SRP100  [DO41-10]
D635  SRP100  [DO41-10]
D636  SRP100  [DO41-10]
D637  SRP100  [DO41-10]
D638  SRP100  [DO41-10]
D639  SRP100  [DO41-10]
D640  SRP100  [DO41-10]
D641  SRP100  [DO41-10]
D642  SRP100  [DO41-10]
D643  SRP100  [DO41-10]
D644  SRP100  [DO41-10]
D645  SRP100  [DO41-10]
D646  SRP100  [DO41-10]
D647  SRP100  [DO41-10]
D648  SRP100  [DO41-10]
D649  SRP100  [DO41-10]
D650  SRP100  [DO41-10]
D651  SRP100  [DO41-10]
D652  SRP100  [DO41-10]
D653  SRP100  [DO41-10]
D654  SRP100  [DO41-10]
D655  SRP100  [DO41-10]
D656  SRP100  [DO41-10]
D657  SRP100  [DO41-10]
D658  SRP100  [DO41-10]
D659  SRP100  [DO41-10]
D660  SRP100  [DO41-10]
D661  SRP100  [DO41-10]
D662  SRP100  [DO41-10]
D663  SRP100  [DO41-10]
D664  SRP100  [DO41-10]
D665  SRP100  [DO41-10]
D666  SRP100  [DO41-10]
D667  SRP100  [DO41-10]
D668  SRP100  [DO41-10]
D669  SRP100  [DO41-10]
D670  SRP100  [DO41-10]
D671  SRP100  [DO41-10]
D672  SRP100  [DO41-10]
D673  SRP100  [DO41-10]
D674  SRP100  [DO41-10]
D675  SRP100  [DO41-10]
D676  SRP100  [DO41-10]
D677  SRP100  [DO41-10]
D678  SRP100  [DO41-10]
D679  SRP100  [DO41-10]
D680  SRP100  [DO41-10]
D681  SRP100  [DO41-10]
D682  SRP100  [DO41-10]
D683  SRP100  [DO41-10]
D684  SRP100  [DO41-10]
D685  SRP100  [DO41-10]
D686  SRP100  [DO41-10]
D687  SRP100  [DO41-10]
D688  SRP100  [DO41-10]
D689  SRP100  [DO41-10]
D690  SRP100  [DO41-10]
D691  SRP100  [DO41-10]
D692  SRP100  [DO41-10]
D693  SRP100  [DO41-10]
D694  SRP100  [DO41-10]
D695  SRP100  [DO41-10]
D696  SRP100  [DO41-10]
D697  SRP100  [DO41-10]
D698  SRP100  [DO41-10]
D699  SRP100  [DO41-10]
D700  SRP100  [DO41-10]
D701  SRP100  [DO41-10]
D702  SRP100  [DO41-10]
D703  SRP100  [DO41-10]
D704  SRP100  [DO41-10]
D705  SRP100  [DO41-10]
D706  SRP100  [DO41-10]
D707  SRP100  [DO41-10]
D708  SRP100  [DO41-10]
D709  SRP100  [DO41-10]
D710  SRP100  [DO41-10]
D711  SRP100  [DO41-10]
D712  SRP100  [DO41-10]
D713  SRP100  [DO41-10]
D714  SRP100  [DO41-10]
D715  SRP100  [DO41-10]
D716  SRP100  [DO41-10]
D717  SRP100  [DO41-10]
D718  SRP100  [DO41-10]
D719  SRP100  [DO41-10]
D720  SRP100  [DO41-10]
D721  SRP100  [DO41-10]
D722  SRP100  [DO41-10]
D723  SRP100  [DO41-10]
D724  SRP100  [DO41-10]
D725  SRP100  [DO41-10]
D726  SRP100  [DO41-10]
D727  SRP100  [DO41-10]
D728  SRP100  [DO41-10]
D729  SRP100  [DO41-10]
D730  SRP100  [DO41-10]
D731  SRP100  [DO41-10]
D732  SRP100  [DO41-10]
D733  SRP100  [DO41-10]
D734  SRP100  [DO41-10]
D735  SRP100  [DO41-10]
D736  SRP100  [DO41-10]
D737  SRP100  [DO41-10]
D738  SRP100  [DO41-10]
D739  SRP100  [DO41-10]
D740  SRP100  [DO41-10]
D741  SRP100  [DO41-10]
D742  SRP100  [DO41-10]
D743  SRP100  [DO41-10]
D744  SRP100  [DO41-10]
D745  SRP100  [DO41-10]
D746  SRP100  [DO41-10]
D747  SRP100  [DO41-10]
D748  SRP100  [DO41-10]
D749  SRP100  [DO41-10]
D750  SRP100  [DO41-10]
D751  SRP100  [DO41-10]
D752  SRP100  [DO41-10]
D753  SRP100  [DO41-10]
D754  SRP100  [DO41-10]
D755  SRP100  [DO41-10]
D756  SRP100  [DO41-10]
D757  SRP100  [DO41-10]
D758  SRP100  [DO41-10]
D759  SRP100  [DO41-10]
D760  SRP100  [DO41-10]
D761  SRP100  [DO41-10]
D762  SRP100  [DO41-10]
D763  SRP100  [DO41-10]
D764  SRP100  [DO41-10]
D765  SRP100  [DO41-10]
D766  SRP100  [DO41-10]
D767  SRP100  [DO41-10]
D768  SRP100  [DO41-10]
D769  SRP100  [DO41-10]
D770  SRP100  [DO41-10]
D771  SRP100  [DO41-10]
D772  SRP100  [DO41-10]
D773  SRP100  [DO41-10]
D774  SRP100  [DO41-10]
D775  SRP100  [DO41-10]
D776  SRP100  [DO41-10]
D777  SRP100  [DO41-10]
D778  SRP100  [DO41-10]
D779  SRP100  [DO41-10]
D780  SRP100  [DO41-10]
D781  SRP100  [DO41-10]
D782  SRP100  [DO41-10]
D783  SRP100  [DO41-10]
D784  SRP100  [DO41-10]
D785  SRP100  [DO41-10]
D786  SRP100  [DO41-10]
D787  SRP100  [DO41-10]
D788  SRP100  [DO41-10]
D789  SRP100  [DO41-10]
D790  SRP100  [DO41-10]
D791  SRP100  [DO41-10]
D792  SRP100  [DO41-10]
D793  SRP100  [DO41-10]
D794  SRP100  [DO41-10]
D795  SRP100  [DO41-10]
D796  SRP100  [DO41-10]
D797  SRP100  [DO41-10]
D798  SRP100  [DO41-10]
D799  SRP100  [DO41-10]
D800  SRP100  [DO41-10]
D801  SRP100  [DO41-10]
D802  SRP100  [DO41-10]
D803  SRP100  [DO41-10]
D804  SRP100  [DO41-10]
D805  SRP100  [DO41-10]
D806  SRP100  [DO41-10]
D807  SRP100  [DO41-10]
D808  SRP100  [DO41-10]
D809  SRP100  [DO41-10]
D810  SRP100  [DO41-10]
D811  SRP100  [DO41-10]
D812  SRP100  [DO41-10]
D813  SRP100  [DO41-10]
D814  SRP100  [DO41-10]
D815  SRP100  [DO41-10]
D816  SRP100  [DO41-10]
D817  SRP100  [DO41-10]
D818  SRP100  [DO41-10]
D819  SRP100  [DO41-10]
D820  SRP100  [DO41-10]
D821  SRP100  [DO41-10]
D822  SRP100  [DO41-10]
D823  SRP100  [DO41-10]
D824  SRP100  [DO41-10]
D825  SRP100  [DO41-10]
D826  SRP100  [DO41-10]
D827  SRP100  [DO41-10]
D828  SRP100  [DO41-10]
D829  SRP100  [DO41-10]
D830  SRP100  [DO41-10]
D831  SRP100  [DO41-10]
D832  SRP100  [DO41-10]
D833  SRP100  [DO41-10]
D834  SRP100  [DO41-10]
D835  SRP100  [DO41-10]
D836  SRP100  [DO41-10]
D837  SRP100  [DO41-10]
D838  SRP100  [DO41-10]
D839  SRP100  [DO41-10]
D840  SRP100  [DO41-10]
D841  SRP100  [DO41-10]
D842  SRP100  [DO41-10]
D843  SRP100  [DO41-10]
D844  SRP100  [DO41-10]
D845  SRP100  [DO41-10]
D846  SRP100  [DO41-10]
D847  SRP100  [DO41-10]
D848  SRP100  [DO41-10]
D849  SRP100  [DO41-10]
D850  SRP100  [DO41-10]
D851  SRP100  [DO41-10]
D852  SRP100  [DO41-10]
D853  SRP100  [DO41-10]
D854  SRP100  [DO41-10]
D855  SRP100  [DO41-10]
D856  SRP100  [DO41-10]
D857  SRP100  [DO41-10]
D858  SRP100  [DO41-10]
D859  SRP100  [DO41-10]
D860  SRP100  [DO41-10]
D861  SRP100  [DO41-10]
D862  SRP100  [DO41-10]
D863  SRP100  [DO41-10]
D864  SRP100  [DO41-10]
D865  SRP100  [DO41-10]
D866  SRP100  [DO41-10]
D867  SRP100  [DO41-10]
D868  SRP100  [DO41-10]
D869  SRP100  [DO41-10]
D870  SRP100  [DO41-10]
D871  SRP100  [DO41-10]
D872  SRP100  [DO41-10]
D873  SRP100  [DO41-10]
D874  SRP100  [DO41-10]
D875  SRP100  [DO41-10]
D876  SRP100  [DO41-10]
D877  SRP100  [DO41-10]
D878  SRP100  [DO41-10]
D879  SRP100  [DO41-10]
D880  SRP100  [DO41-10]
D881  SRP100  [DO41-10]
D882  SRP100  [DO41-10]
D883  SRP100  [DO41-10]
D884  SRP100  [DO41-10]
D885  SRP100  [DO41-10]
D886  SRP100  [DO41-10]
D887  SRP100  [DO41-10]
D888  SRP100  [DO41-10]
D889  SRP100  [DO41-10]
D890  SRP100  [DO41-10]
D891  SRP100  [DO41-10]
D892  SRP100  [DO41-10]
D893  SRP100  [DO41-10]
D894  SRP100  [DO41-10]
D895  SRP100  [DO41-10]
D896  SRP100  [DO41-10]
D897  SRP100  [DO41-10]
D898  SRP100  [DO41-10]
D899  SRP100  [DO41-10]
D900  SRP100  [DO41-10]
D901  SRP100  [DO41-10]
D902  SRP100  [DO41-10]
D903  SRP100  [DO41-10]
D904  SRP100  [DO41-10]
D905  SRP100  [DO41-10]
D906  SRP100  [DO41-10]
D907  SRP100  [DO41-10]
D908  SRP100  [DO41-10]
D909  SRP100  [DO41-10]
D910  SRP100  [DO41-10]
D911  SRP100  [DO41-10]
D912  SRP100  [DO41-10]
D913  SRP100  [DO41-10]
D914  SRP100  [DO41-10]
D915  SRP100  [DO41-10]
D916  SRP100  [DO41-10]
D917  SRP100  [DO41-10]
D918  SRP100  [DO41-10]
D919  SRP100  [DO41-10]
D920  SRP100  [DO41-10]
D921  SRP100  [DO41-10]
D922  SRP100  [DO41-10]
D923  SRP100  [DO41-10]
D924  SRP100  [DO41-10]
D925  SRP100  [DO41-10]
D926  SRP100  [DO41-10]
D927  SRP100  [DO41-10]
D928  SRP100  [DO41-10]
D929  SRP100  [DO41-10]
D930  SRP100  [DO41-10]
D931  SRP100  [DO41-10]
D932  SRP100  [DO41-10]
D933  SRP100  [DO41-10]
D934  SRP100  [DO41-10]
D935  SRP100  [DO41-10]
D936  SRP100  [DO41-10]
D937  SRP100  [DO41-10]
D938  SRP100  [DO41-10]
D939  SRP100  [DO41-10]
D940  SRP100  [DO41-10]
D941  SRP100  [DO41-10]
D942  SRP100  [DO41-10]
D943  SRP100  [DO41-10]
D944  SRP100  [DO41-10]
D945  SRP100  [DO41-10]
D946  SRP100  [DO41-10]
D947  SRP100  [DO41-10]
D948  SRP100  [DO41-10]
D949  SRP100  [DO41-10]
D950  SRP100  [DO41-10]
D951  SRP100  [DO41-10]
D952  SRP100  [DO41-10]
D953  SRP100  [DO41-10]
D954  SRP100  [DO41-10]
D955  SRP100  [DO41-10]
D956  SRP100  [DO41-10]
D957  SRP100  [DO41-10]
D958  SRP100  [DO41-10]
D959  SRP100  [DO41-10]
D960  SRP100  [DO41-10]
D961  SRP100  [DO41-10]
D962  SRP100  [DO41-10]
D963  SRP100  [DO41-10]
D964  SRP100  [DO41-10]
D965  SRP100  [DO41-10]
D966  SRP100  [DO41-10]
D967  SRP100  [DO41-10]
D968  SRP100  [DO41-10]
D969  SRP100  [DO41-10]
D970  SRP100  [DO41-10]
D971  SRP100  [DO41-10]
D972  SRP100  [DO41-10]
D973  SRP100  [DO41-10]
D974  SRP100  [DO41-10]
D975  SRP100  [DO41-10]
D976  SRP100  [DO41-10]
D977  SRP100  [DO41-10]
D978  SRP100  [DO41-10]
D979  SRP100  [DO41-10]
D980  SRP100  [DO41-10]
D981  SRP100  [DO41-10]
D982  SRP100  [DO41-10]
D983  SRP100  [DO41-10]
D984  SRP100  [DO41-10]
D985  SRP100  [DO41-10]
D986  SRP100  [DO41-10]
D987  SRP100  [DO41-10]
D988  SRP100  [DO41-10]
D989  SRP100  [DO41-10]
D990  SRP100  [DO41-10]
D991  SRP100  [DO41-10]
D992  SRP100  [DO41-10]
D993  SRP100  [DO41-10]
D994  SRP100  [DO41-10]
D995  SRP100  [DO41-10]
D996  SRP100  [DO41-10]
D997  SRP100  [DO41-10]
D998  SRP100  [DO41-10]
D999  SRP100  [DO41-10]
D1000  SRP100  [DO41-10]
D1001  SRP100  [DO41-10]
D1002  SRP100  [DO41-10]
D1003  SRP100  [DO41-10]
D1004  SRP100  [DO41-10]
D1005  SRP100  [DO41-10]
D1006  SRP100  [DO41-10]
D1007  SRP100  [DO41-10]
D1008  SRP100  [DO41-10]
D1009  SRP100  [DO41-10]
D1010  SRP100  [DO41-10]
D1011  SRP100  [DO41-10]
D1012  SRP100  [DO41-10]
D1013  SRP100  [DO41-10]
D1014  SRP100  [DO41-10]
D1015  SRP100  [DO41-10]
D1016  SRP100  [DO41-10]
D1017  SRP100  [DO41-10]
D1018  SRP100  [DO41-10]
D1019  SRP100  [DO41-10]
D1020  SRP100  [DO41-10]
D1021  SRP100  [DO41-10]
D1022  SRP100  [DO41-10]
D1023  SRP100  [DO41-10]
D1024  SRP100  [DO41-10]
IC1  8086  [DIL40]
IC2  74HC373DW  [SO20W]
IC3  74HC373DW  [SO20W]
IC4  74HC373DW  [SO20W]
IC5  74LS132FK  [LCC20]
IC6  7425D  [SO14]
IC7  74LS132D  [SO14]
IC8  74AHC1G32DBV  [SOT23-5]
IC9  74AHC1G32DBV  [SOT23-5]
IC10  74HC373N  [DIL20]
IC11  74AHC1G32DBV  [SOT23-5]
IC12  74AHC1G32DBV  [SOT23-5]
IC13  74HC373N  [DIL20]
IC15  74HC373N  [DIL20]
IC16  74HC373N  [DIL20]
IC17  74HC373N  [DIL20]
IC18  74HC373N  [DIL20]
IC19  74HC373N  [DIL20]
IC20  74HC373N  [DIL20]
IC21  74HC373N  [DIL20]
IC22  74HC373N  [DIL20]
IC23  74HC373N  [DIL20]
IC24  74HC373N  [DIL20]
IC25  74HC373N  [DIL20]
IC26  74HC373N  [DIL20]
IC27  74HC373N  [DIL20]
IC28  74HC373N  [DIL20]
IC29  74HC373N  [DIL20]
Q1  MC-405  [MC-405]
Q2  PNP-TRANSISTIOR-2COLSOT89  [SOT89]
Q3  PNP-TRANSISTIOR-2COLSOT89  [SOT89]
Q4  PNP-TRANSISTIOR-2COLSOT89  [SOT89]
Q5  PNP-TRANSISTIOR-2COLSOT89  [SOT89]
Q6  PNP-TRANSISTIOR-2COLSOT89  [SOT89]
Q7  PNP-TRANSISTIOR-2COLSOT89  [SOT89]
Q8  PNP-TRANSISTIOR-2COLSOT89  [SOT89]
Q9  PNP-TRANSISTIOR-2COLSOT89  [SOT89]
Q10  PNP-TRANSISTIOR-2COLSOT89  [SOT89]
Q11  PNP-TRANSISTIOR-2COLSOT89  [SOT89]
Q12  PNP-TRANSISTIOR-2COLSOT89  [SOT89]
Q13  PNP-TRANSISTIOR-2COLSOT89  [SOT89]
Q14  PNP-TRANSISTIOR-2COLSOT89  [SOT89]
Q15  PNP-TRANSISTIOR-2COLSOT89  [SOT89]
Q16  PNP-TRANSISTIOR-2COLSOT89  [SOT89]
Q17  PNP-TRANSISTIOR-2COLSOT89  [SOT89]
Q18  PNP-TRANSISTIOR-2COLSOT89  [SOT89]
Q19  PNP-TRANSISTIOR-2COLSOT89  [SOT89]
Q20  PNP-TRANSISTIOR-2COLSOT89  [SOT89]
Q21  PNP-TRANSISTIOR-2COLSOT89  [SOT89]
Q22  PNP-TRANSISTIOR-2COLSOT89  [SOT89]
Q23  PNP-TRANSISTIOR-2COLSOT89  [SOT89]
Q24  PNP-TRANSISTIOR-2COLSOT89  [SOT89]
Q25  PNP-TRANSISTIOR-2COLSOT89  [SOT89]
Q26  PNP-TRANSISTIOR-2COLSOT89  [SOT89]
Q27  PNP-TRANSISTIOR-2COLSOT89  [SOT89]
Q28  PNP-TRANSISTIOR-2COLSOT89  [SOT89]
Q29  PNP-TRANSISTIOR-2COLSOT89  [SOT89]
Q30  PNP-TRANSISTIOR-2COLSOT89  [SOT89]
Q31  PNP-TRANSISTIOR-2COLSOT89  [SOT89]
Q32  PNP-TRANSISTIOR-2COLSOT89  [SOT89]
Q33  PNP-TRANSISTIOR-2COLSOT89  [SOT89]
Q34  PNP-TRANSISTIOR-2COLSOT89  [SOT89]
Q35  PNP-TRANSISTIOR-2COLSOT89  [SOT89]
Q36  PNP-TRANSISTIOR-2COLSOT89  [SOT89]
Q37  PNP-TRANSISTIOR-2COLSOT89  [SOT89]
Q38  PNP-TRANSISTIOR-2COLSOT89  [SOT89]
Q39  PNP-TRANSISTIOR-2COLSOT89  [SOT89]
Q40  PNP-TRANSISTIOR-2COLSOT89  [SOT89]
Q41  PNP-TRANSISTIOR-2COLSOT89  [SOT89]
Q42  PNP-TRANSISTIOR-2COLSOT89  [SOT89]
Q43  PNP-TRANSISTIOR-2COLSOT89  [SOT89]
Q44  PNP-TRANSISTIOR-2COLSOT89  [SOT89]
Q45  PNP-TRANSISTIOR-2COLSOT89  [SOT89]
Q46  PNP-TRANSISTIOR-2COLSOT89  [SOT89]
Q47  PNP-TRANSISTIOR-2COLSOT89  [SOT89]
Q48  PNP-TRANSISTIOR-2COLSOT89  [SOT89]
Q49  PNP-TRANSISTIOR-2COLSOT89  [SOT89]
Q50  PNP-TRANSISTIOR-2COLSOT89  [SOT89]
Q51  PNP-TRANSISTIOR-2COLSOT89  [SOT89]
Q52  PNP-TRANSISTIOR-2COLSOT89  [SOT89]
Q53  PNP-TRANSISTIOR-2COLSOT89  [SOT89]
Q54  PNP-TRANSISTIOR-2COLSOT89  [SOT89]
Q55  PNP-TRANSISTIOR-2COLSOT89  [SOT89]
Q56  PNP-TRANSISTIOR-2COLSOT89  [SOT89]
Q57  PNP-TRANSISTIOR-2COLSOT89  [SOT89]
Q58  PNP-TRANSISTIOR-2COLSOT89  [SOT89]
Q59  PNP-TRANSISTIOR-2COLSOT89  [SOT89]
Q60  PNP-TRANSISTIOR-2COLSOT89  [SOT89]
Q61  PNP-TRANSISTIOR-2COLSOT89  [SOT89]
Q62  PNP-TRANSISTIOR-2COLSOT89  [SOT89]
Q63  PNP-TRANSISTIOR-2COLSOT89  [SOT89]
Q64  PNP-TRANSISTIOR-2COLSOT89  [SOT89]
Q65  PNP-TRANSISTIOR-2COLSOT89  [SOT89]
Q66  PNP-TRANSISTIOR-2COLSOT89  [SOT89]
Q67  PNP-TRANSISTIOR-2COLSOT89  [SOT89]
Q68  PNP-TRANSISTIOR-2COLSOT89  [SOT89]
Q69  PNP-TRANSISTIOR-2COLSOT89  [SOT89]
Q70  PNP-TRANSISTIOR-2COLSOT89  [SOT89]
Q71  PNP-TRANSISTIOR-2COLSOT89  [SOT89]
Q72  PNP-TRANSISTIOR-2COLSOT89  [SOT89]
Q73  PNP-TRANSISTIOR-2COLSOT89  [SOT89]
Q74  PNP-TRANSISTIOR-2COLSOT89  [SOT89]
Q75  PNP-TRANSISTIOR-2COLSOT89  [SOT89]
Q76  PNP-TRANSISTIOR-2COLSOT89  [SOT89]
Q77  PNP-TRANSISTIOR-2COLSOT89  [SOT89]
Q78  PNP-TRANSISTIOR-2COLSOT89  [SOT89]
Q79  PNP-TRANSISTIOR-2COLSOT89  [SOT89]
Q80  PNP-TRANSISTIOR-2COLSOT89  [SOT89]
Q81  PNP-TRANSISTIOR-2COLSOT89  [SOT89]
Q82  PNP-TRANSISTIOR-2COLSOT89  [SOT89]
Q83  PNP-TRANSISTIOR-2COLSOT89  [SOT89]
Q84  PNP-TRANSISTIOR-2COLSOT89  [SOT89]
Q85  PNP-TRANSISTIOR-2COLSOT89  [SOT89]
Q86  PNP-TRANSISTIOR-2COLSOT89  [SOT89]
Q87  PNP-TRANSISTIOR-2COLSOT89  [SOT89]
Q88  PNP-TRANSISTIOR-2COLSOT89  [SOT89]
Q89  PNP-TRANSISTIOR-2COLSOT89  [SOT89]
Q90  PNP-TRANSISTIOR-2COLSOT89  [SOT89]
Q91  PNP-TRANSISTIOR-2COLSOT89  [SOT89]
Q92  PNP-TRANSISTIOR-2COLSOT89  [SOT89]
Q93  PNP-TRANSISTIOR-2COLSOT89  [SOT89]
Q94  PNP-TRANSISTIOR-2COLSOT89  [SOT89]
Q95  PNP-TRANSISTIOR-2COLSOT89  [SOT89]
Q96  PNP-TRANSISTIOR-2COLSOT89  [SOT89]
Q97  PNP-TRANSISTIOR-2COLSOT89  [SOT89]
Q98  PNP-TRANSISTIOR-2COLSOT89  [SOT89]
Q99  PNP-TRANSISTIOR-2COLSOT89  [SOT89]
Q100  PNP-TRANSISTIOR-2COLSOT89  [SOT89]
Q101  PNP-TRANSISTIOR-2COLSOT89  [SOT89]
Q102  PNP-TRANSISTIOR-2COLSOT89  [SOT89]
Q103  PNP-TRANSISTIOR-2COLSOT89  [SOT89]
Q104  PNP-TRANSISTIOR-2COLSOT89  [SOT89]
Q105  PNP-TRANSISTIOR-2COLSOT89  [SOT89]
Q106  PNP-TRANSISTIOR-2COLSOT89  [SOT89]
Q107  PNP-TRANSISTIOR-2COLSOT89  [SOT89]
Q108  PNP-TRANSISTIOR-2COLSOT89  [SOT89]
Q109  PNP-TRANSISTIOR-2COLSOT89  [SOT89]
Q110  PNP-TRANSISTIOR-2COLSOT89  [SOT89]
Q111  PNP-TRANSISTIOR-2COLSOT89  [SOT89]
Q112  PNP-TRANSISTIOR-2COLSOT89  [SOT89]
Q113  PNP-TRANSISTIOR-2COLSOT89  [SOT89]
Q114  PNP-TRANSISTIOR-2COLSOT89  [SOT89]
Q115  PNP-TRANSISTIOR-2COLSOT89  [SOT89]
Q116  PNP-TRANSISTIOR-2COLSOT89  [SOT89]
Q117  PNP-TRANSISTIOR-2COLSOT89  [SOT89]
Q118  PNP-TRANSISTIOR-2COLSOT89  [SOT89]
Q119  PNP-TRANSISTIOR-2COLSOT89  [SOT89]
Q120  PNP-TRANSISTIOR-2COLSOT89  [SOT89]
Q121  PNP-TRANSISTIOR-2COLSOT89  [SOT89]
Q122  PNP-TRANSISTIOR-2COLSOT89  [SOT89]
Q123  PNP-TRANSISTIOR-2COLSOT89  [SOT89]
Q124  PNP-TRANSISTIOR-2COLSOT89  [SOT89]
Q125  PNP-TRANSISTIOR-2COLSOT89  [SOT89]
Q126  PNP-TRANSISTIOR-2COLSOT89  [SOT89]
Q127  PNP-TRANSISTIOR-2COLSOT89  [SOT89]
Q128  PNP-TRANSISTIOR-2COLSOT89  [SOT89]
Q129  PNP-TRANSISTIOR-2COLSOT89  [SOT89]
U$1  8284A8284A  [8284A]
U$2  2712827128  [27128]
U$3  2712827128  [27128]
U$4  6212862128  [62128]
U$5  6212862128  [62128]
U$6  PUSHBUTTONPUSHBUTTON  [PUSHBUTTON]
X1  OR  (no package)
X2  OR  (no package)
X3  OR  (no package)
X4  OR  (no package)
X5  OR  (no package)
X6  OR  (no package)
X7  OR  (no package)
X8  OR  (no package)
X9  OR  (no package)
X10  OR  (no package)
X11  OR  (no package)
X12  OR  (no package)
X13  OR  (no package)
X14  OR  (no package)
X15  OR  (no package)
X16  OR  (no package)
X17  OR  (no package)
X18  INVERTER  (no package)
X19  OR  (no package)
X20  OR  (no package)
X21  OR  (no package)
X22  INVERTER  (no package)
X23  OR  (no package)
X24  OR  (no package)
X25  OR  (no package)
X26  OR  (no package)